# Altium project PATHOS_ControllerBoardExp.PrjPCB (part 1 of 2)
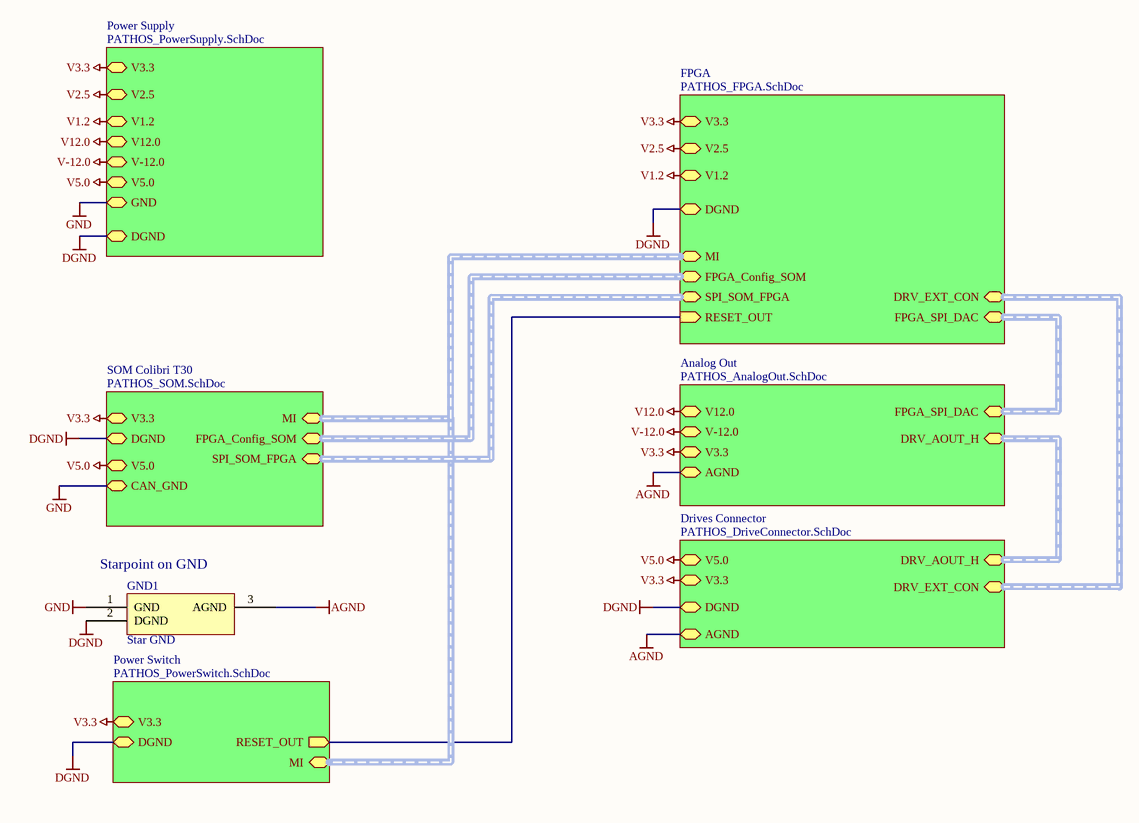
[diagram p0: PATHOS_ControllerBoardExp.SchDoc]
15 sheets, 171 parts. Net scope: strictly hierarchical (ports join the sheet entries above them; power ports are local).
Board file: PATHOS_ControllerBoardExp.PcbDoc
Sheets:
  PATHOS_ControllerBoardExp.SchDoc
    FPGA = PATHOS_FPGA.SchDoc
      Power Supply FPGA = PATHOS_FPGA_Power.SchDoc
      FPGA Clk = PATHOS_FPGA_Clk.SchDoc
      FPGA_IO = PATHOS_FPGA_IO.SchDoc
        IO External = PATHOS_FPGA_IO_Ext.SchDoc
      FPGA MemoryInterface = PATHOS_FPGA_MemoryInterface.SchDoc
    SOM Colibri T30 = PATHOS_SOM.SchDoc
      Power Supply = PATHOS_SOM_Power.SchDoc
      SOM IOs = PATHOS_SOM_IO.SchDoc
      SOM UART = PATHOS_SOM_UART.SchDoc
      SOM Ethernet = PATHOS_SOM_Ethernet.SchDoc
      SOM CAN = PATHOS_SOM_CAN.SchDoc
    Power Switch = PATHOS_PowerSwitch.SchDoc
    Analog Out = PATHOS_AnalogOut.SchDoc

## Sheet PATHOS_ControllerBoardExp.SchDoc: Main Schematic
size A4; Author: A. Kalberer; CompanyName: NTB; Organization: NTB Interstate University of Applied; Address1: Werdenbergstrasse 4; Address3: 9471 Buchs; Address4: Switzerland; Revision: 0.1; SheetNumber: 1; SheetTotal: 2; Organization1: Sciences of Technology Buchs; Size: A4

### Parts
GND1  Star GND  [NetTieGND]  (net tie, no BOM)

### Sub-sheets
Analog Out = PATHOS_AnalogOut.SchDoc: FPGA_SPI_DAC (harness FPGA_SPI_DAC), V12.0, V-12.0, AGND, V3.3, DRV_AOUT_H (harness DRV_AOUT_H)
Drives Connector = PATHOS_DriveConnector.SchDoc (file not in this document): DRV_EXT_CON (harness DRV_EXT_CON), DRV_AOUT_H (harness DRV_AOUT_H), V5.0, DGND, AGND, V3.3
FPGA = PATHOS_FPGA.SchDoc: V3.3, V2.5, V1.2, DGND (bidir), MI (harness MI), FPGA_Config_SOM (harness FPGA_Config_SOM), RESET_OUT (in), SPI_SOM_FPGA (harness SPI_SOM_FPGA), FPGA_SPI_DAC (harness FPGA_SPI_DAC), DRV_EXT_CON (harness DRV_EXT_CON)
Power Supply = PATHOS_PowerSupply.SchDoc (file not in this document): GND, V1.2, V2.5, V3.3, V5.0, V12.0, V-12.0, DGND
Power Switch = PATHOS_PowerSwitch.SchDoc: V3.3, DGND, MI (harness MI), RESET_OUT (out)
SOM Colibri T30 = PATHOS_SOM.SchDoc: V3.3, DGND (bidir), MI (harness MI), FPGA_Config_SOM (harness FPGA_Config_SOM), SPI_SOM_FPGA (harness SPI_SOM_FPGA), V5.0, CAN_GND

### Nets
AGND: GND1.3(AGND) ; sheet Analog Out/AGND, sheet Drives Connector/AGND
DGND: GND1.2(DGND) ; sheet Power Supply/DGND, sheet FPGA/DGND, sheet SOM Colibri T30/DGND, sheet Power Switch/DGND, sheet Drives Connector/DGND
GND: GND1.1(GND) ; sheet Power Supply/GND, sheet SOM Colibri T30/CAN_GND  [project net CAN_GND]
V1.2: sheet Power Supply/V1.2, sheet FPGA/V1.2
V2.5: sheet Power Supply/V2.5, sheet FPGA/V2.5
V3.3: sheet Power Supply/V3.3, sheet FPGA/V3.3, sheet SOM Colibri T30/V3.3, sheet Power Switch/V3.3, sheet Analog Out/V3.3, sheet Drives Connector/V3.3
V5.0: sheet Power Supply/V5.0, sheet SOM Colibri T30/V5.0, sheet Drives Connector/V5.0
V12.0: sheet Power Supply/V12.0, sheet Analog Out/V12.0
V-12.0: sheet Power Supply/V-12.0, sheet Analog Out/V-12.0
RESET_OUT: sheet FPGA/RESET_OUT, sheet Power Switch/RESET_OUT

### Buses and harness runs
harness sheet Analog Out/DRV_AOUT_H = sheet Drives Connector/DRV_AOUT_H
harness sheet Analog Out/FPGA_SPI_DAC = sheet FPGA/FPGA_SPI_DAC
harness sheet Drives Connector/DRV_EXT_CON = sheet FPGA/DRV_EXT_CON
harness sheet FPGA/FPGA_Config_SOM = sheet SOM Colibri T30/FPGA_Config_SOM
harness sheet FPGA/MI = sheet Power Switch/MI = sheet SOM Colibri T30/MI
harness sheet FPGA/SPI_SOM_FPGA = sheet SOM Colibri T30/SPI_SOM_FPGA

### Notes on the sheet
- (near GND1) Starpoint on GND
- Title:
- Description:
- Size:
- Date:
- Name:
- Number:
- Time:
- Revision:
- Sheet
- Checked:
- of
- File:

### Library data of the parts
GND1 = NetTie

## Sheet PATHOS_FPGA.SchDoc: FPGA Overview
size A4; Author: A. Kalberer; CompanyName: NTB; Organization: NTB Interstate University of Applied; Address1: Werdenbergstrasse 4; Address3: 9471 Buchs; Address4: Switzerland; Revision: 0.1; Organization1: Sciences of Technology Buchs; Size: A4
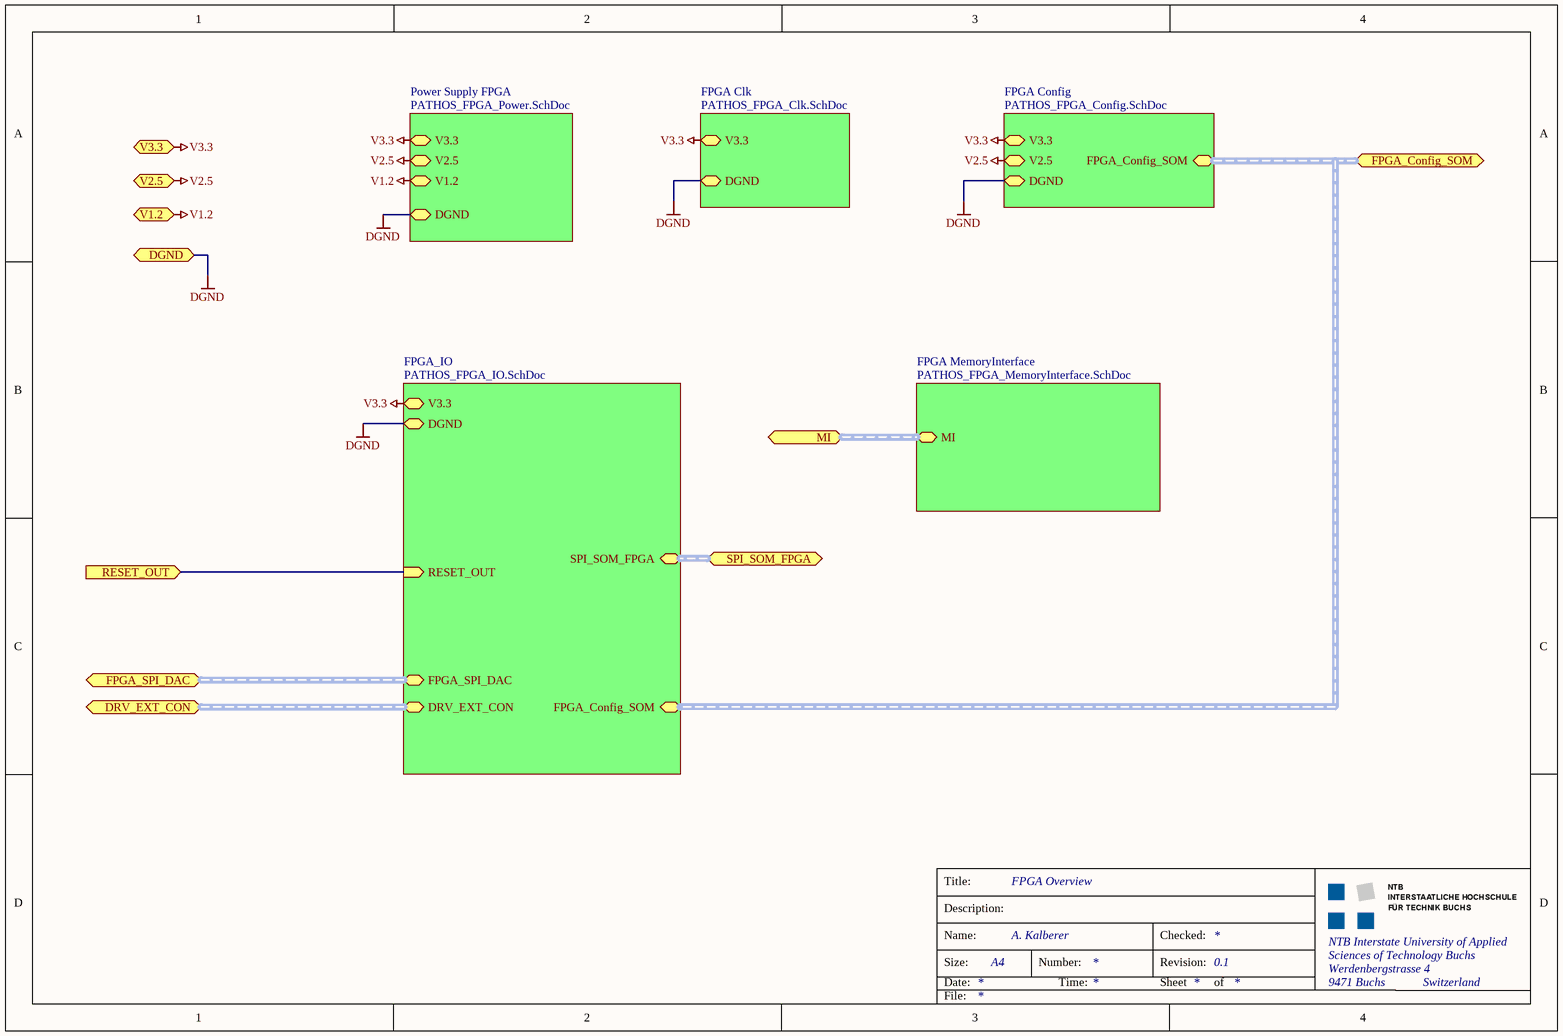
[diagram p1: PATHOS_FPGA.SchDoc]

### Sub-sheets
FPGA Clk = PATHOS_FPGA_Clk.SchDoc: V3.3, DGND
FPGA Config = PATHOS_FPGA_Config.SchDoc (file not in this document): V3.3, DGND, V2.5, FPGA_Config_SOM (harness FPGA_Config_SOM)
FPGA MemoryInterface = PATHOS_FPGA_MemoryInterface.SchDoc: MI (harness MI)
FPGA_IO = PATHOS_FPGA_IO.SchDoc: RESET_OUT (in), SPI_SOM_FPGA (harness SPI_SOM_FPGA), FPGA_Config_SOM (harness FPGA_Config_SOM), FPGA_SPI_DAC (harness FPGA_SPI_DAC), V3.3, DGND, DRV_EXT_CON (harness DRV_EXT_CON)
Power Supply FPGA = PATHOS_FPGA_Power.SchDoc: V3.3, V2.5, V1.2, DGND

### Ports
DGND, DRV_EXT_CON (harness DRV_EXT_CON), FPGA_Config_SOM (harness FPGA_Config_SOM), FPGA_SPI_DAC (harness FPGA_SPI_DAC), MI (harness MI), RESET_OUT (in), SPI_SOM_FPGA (harness SPI_SOM_FPGA), V1.2, V2.5, V3.3

### Nets
DGND: port DGND, sheet Power Supply FPGA/DGND, sheet FPGA Clk/DGND, sheet FPGA_IO/DGND, sheet FPGA Config/DGND
V1.2: port V1.2, sheet Power Supply FPGA/V1.2
V2.5: port V2.5, sheet Power Supply FPGA/V2.5, sheet FPGA Config/V2.5
V3.3: port V3.3, sheet Power Supply FPGA/V3.3, sheet FPGA Clk/V3.3, sheet FPGA_IO/V3.3, sheet FPGA Config/V3.3
RESET_OUT: port RESET_OUT, sheet FPGA_IO/RESET_OUT

### Buses and harness runs
harness port DRV_EXT_CON = sheet FPGA_IO/DRV_EXT_CON
harness port FPGA_Config_SOM = sheet FPGA Config/FPGA_Config_SOM = sheet FPGA_IO/FPGA_Config_SOM
harness port FPGA_SPI_DAC = sheet FPGA_IO/FPGA_SPI_DAC
harness port MI = sheet FPGA MemoryInterface/MI
harness port SPI_SOM_FPGA = sheet FPGA_IO/SPI_SOM_FPGA

### Notes on the sheet
- Title:
- Description:
- Size:
- Date:
- Name:
- Number:
- Time:
- Revision:
- Sheet
- Checked:
- of
- File:

## Sheet PATHOS_FPGA_Power.SchDoc: FPGA Power
size A4; Author: A. Kalberer; CompanyName: NTB; Organization: NTB Interstate University of Applied; Address1: Werdenbergstrasse 4; Address3: 9471 Buchs; Address4: Switzerland; Organization1: Sciences of Technology Buchs; Size: A4
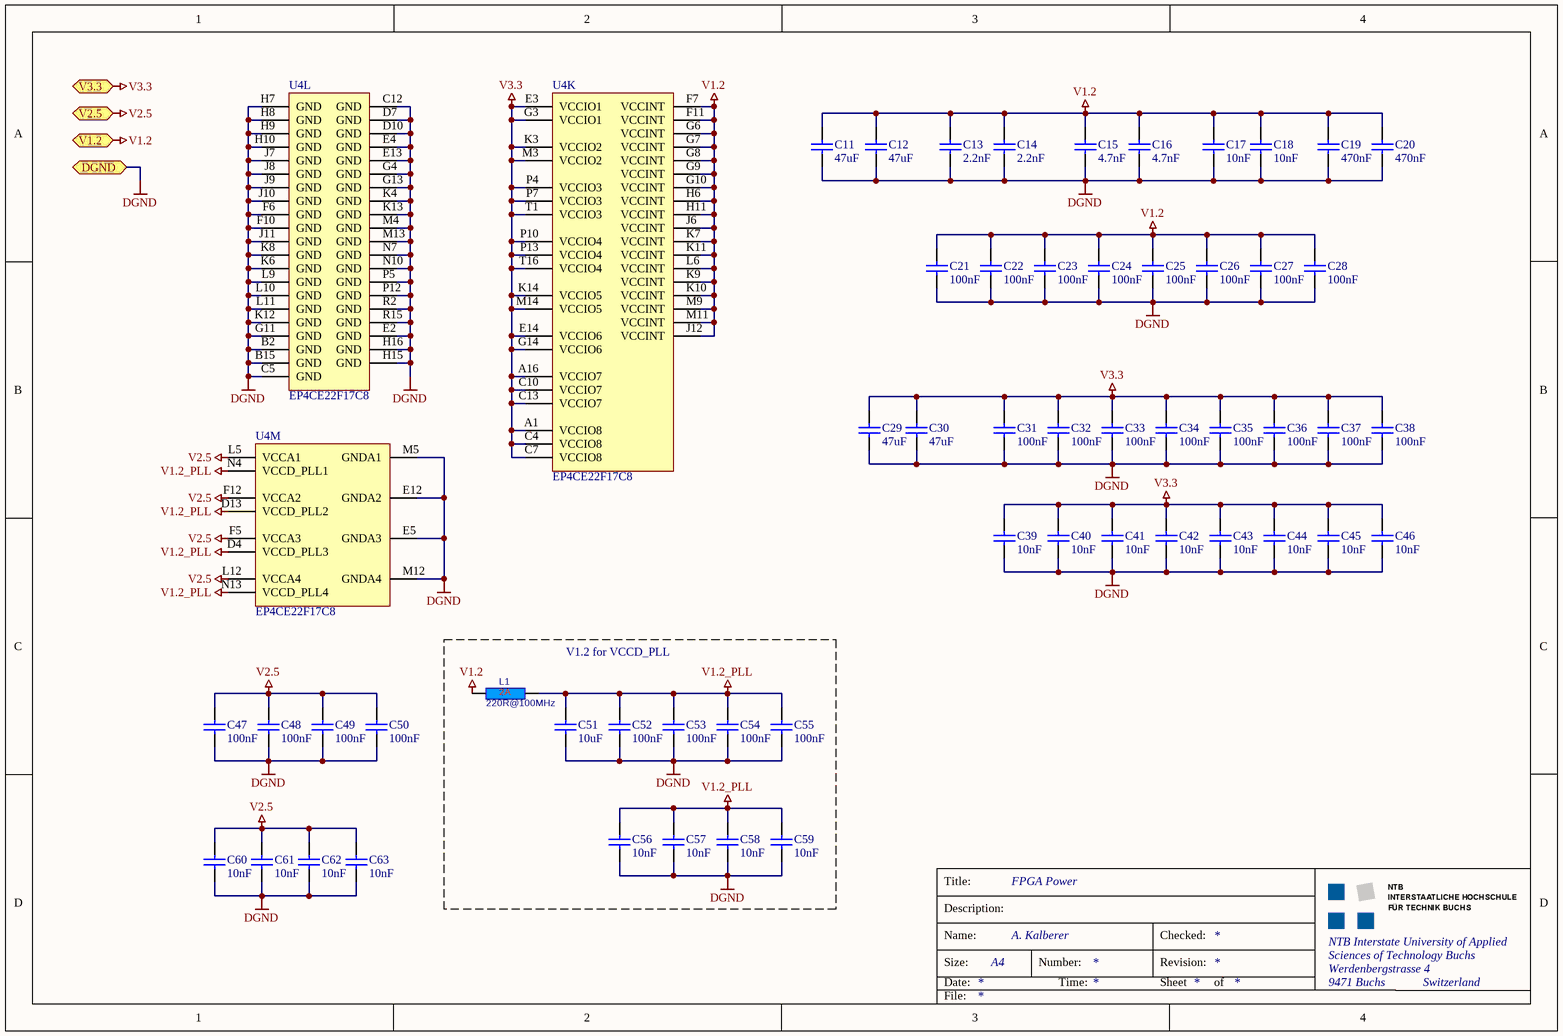
[diagram p2: PATHOS_FPGA_Power.SchDoc]

### Parts
C11  47uF  [0805_3D]
C12  47uF  [0805_3D]
C13  2.2nF  [0402_3D]
C14  2.2nF  [0402_3D]
C15  4.7nF  [0402_3D]
C16  4.7nF  [0402_3D]
C17  10nF  [0402_3D]
C18  10nF  [0402_3D]
C19  470nF  [0603_3D]
C20  470nF  [0603_3D]
C21  100nF  [0402_3D]
C22  100nF  [0402_3D]
C23  100nF  [0402_3D]
C24  100nF  [0402_3D]
C25  100nF  [0402_3D]
C26  100nF  [0402_3D]
C27  100nF  [0402_3D]
C28  100nF  [0402_3D]
C29  47uF  [0805_3D]
C30  47uF  [0805_3D]
C31  100nF  [0402_3D]
C32  100nF  [0402_3D]
C33  100nF  [0402_3D]
C34  100nF  [0402_3D]
C35  100nF  [0402_3D]
C36  100nF  [0402_3D]
C37  100nF  [0402_3D]
C38  100nF  [0402_3D]
C39  10nF  [0402_3D]
C40  10nF  [0402_3D]
C41  10nF  [0402_3D]
C42  10nF  [0402_3D]
C43  10nF  [0402_3D]
C44  10nF  [0402_3D]
C45  10nF  [0402_3D]
C46  10nF  [0402_3D]
C47  100nF  [0402_3D]
C48  100nF  [0402_3D]
C49  100nF  [0402_3D]
C50  100nF  [0402_3D]
C51  10uF  [0603_3D]
C52  100nF  [0402_3D]
C53  100nF  [0402_3D]
C54  100nF  [0402_3D]
C55  100nF  [0402_3D]
C56  10nF  [0402_3D]
C57  10nF  [0402_3D]
C58  10nF  [0402_3D]
C59  10nF  [0402_3D]
C60  10nF  [0402_3D]
C61  10nF  [0402_3D]
C62  10nF  [0402_3D]
C63  10nF  [0402_3D]
L1  220R@100MHz  [0603_3D]
U4  EP4CE22F17C8  [FBGA256]  (parts K,L,M of 13)

### Blocks framed on the sheet
V1.2 for VCCD_PLL: C51-C59 L1

### Ports
DGND, V1.2, V2.5, V3.3

### Nets
DGND: C11.1 C12.1 C13.1 C14.1 C15.1 C16.1 C17.1 C18.1 C19.1 C20.1 C21.1 C22.1 C23.1 C24.1 C25.1 C26.1 C27.1 C28.1 C29.1 C30.1 C31.1 C32.1 C33.1 C34.1 C35.1 C36.1 C37.1 C38.1 C39.1 C40.1 C41.1 C42.1 C43.1 C44.1 C45.1 C46.1 C47.1 C48.1 C49.1 C50.1 C51.1 C52.1 C53.1 C54.1 C55.1 C56.1 C57.1 C58.1 C59.1 C60.1 C61.1 C62.1 C63.1 U4.B2(GND) U4.B15(GND) U4.C5(GND) U4.C12(GND) U4.D7(GND) U4.D10(GND) U4.E2(GND) U4.E4(GND) U4.E5(GNDA3) U4.E12(GNDA2) U4.E13(GND) U4.F6(GND) U4.F10(GND) U4.G4(GND) U4.G11(GND) U4.G13(GND) U4.H7(GND) U4.H8(GND) U4.H9(GND) U4.H10(GND) U4.H15(GND) U4.H16(GND) U4.J7(GND) U4.J8(GND) U4.J9(GND) U4.J10(GND) U4.J11(GND) U4.K4(GND) U4.K6(GND) U4.K8(GND) U4.K12(GND) U4.K13(GND) U4.L9(GND) U4.L10(GND) U4.L11(GND) U4.M4(GND) U4.M5(GNDA1) U4.M12(GNDA4) U4.M13(GND) U4.N7(GND) U4.N10(GND) U4.P5(GND) U4.P12(GND) U4.R2(GND) U4.R15(GND) ; port DGND
V1.2: C11.2 C12.2 C13.2 C14.2 C15.2 C16.2 C17.2 C18.2 C19.2 C20.2 C21.2 C22.2 C23.2 C24.2 C25.2 C26.2 C27.2 C28.2 L1.1 U4.F7(VCCINT) U4.F11(VCCINT) U4.G6(VCCINT) U4.G7(VCCINT) U4.G8(VCCINT) U4.G9(VCCINT) U4.G10(VCCINT) U4.H6(VCCINT) U4.H11(VCCINT) U4.J6(VCCINT) U4.J12(VCCINT) U4.K7(VCCINT) U4.K9(VCCINT) U4.K10(VCCINT) U4.K11(VCCINT) U4.L6(VCCINT) U4.M9(VCCINT) U4.M11(VCCINT) ; port V1.2
V1.2_PLL: C51.2 C52.2 C53.2 C54.2 C55.2 C56.2 C57.2 C58.2 C59.2 L1.2 U4.D4(VCCD_PLL3) U4.D13(VCCD_PLL2) U4.N4(VCCD_PLL1) U4.N13(VCCD_PLL4)
V2.5: C47.2 C48.2 C49.2 C50.2 C60.2 C61.2 C62.2 C63.2 U4.F5(VCCA3) U4.F12(VCCA2) U4.L5(VCCA1) U4.L12(VCCA4) ; port V2.5
V3.3: C29.2 C30.2 C31.2 C32.2 C33.2 C34.2 C35.2 C36.2 C37.2 C38.2 C39.2 C40.2 C41.2 C42.2 C43.2 C44.2 C45.2 C46.2 U4.A1(VCCIO8) U4.A16(VCCIO7) U4.C4(VCCIO8) U4.C7(VCCIO8) U4.C10(VCCIO7) U4.C13(VCCIO7) U4.E3(VCCIO1) U4.E14(VCCIO6) U4.G3(VCCIO1) U4.G14(VCCIO6) U4.K3(VCCIO2) U4.K14(VCCIO5) U4.M3(VCCIO2) U4.M14(VCCIO5) U4.P4(VCCIO3) U4.P7(VCCIO3) U4.P10(VCCIO4) U4.P13(VCCIO4) U4.T1(VCCIO3) U4.T16(VCCIO4) ; port V3.3

### Notes on the sheet
- Title:
- Description:
- Size:
- Date:
- Name:
- Number:
- Time:
- Revision:
- Sheet
- Checked:
- of
- File:

### Library data of the parts
C11 C12 C29 C30 = C: Capacitor; #Manufacturer: Generic Components; #Publisher: Dr. A. Heinzelmann; #Class: Passive; Initial Voltage: 0V; Type: Ceramic; #Published: 2006-10-07; #ClassSub: Capacitor; Voltage Maximum: *; Value: 47uF
C13-C28 C31-C63 = C: Capacitor; #Manufacturer: Generic Components; #Publisher: Dr. A. Heinzelmann; #Class: Passive; Initial Voltage: 0V; #Published: 2006-10-07; #ClassSub: Capacitor; Type: *; Voltage Maximum: *
  C13 C14: Value: 2.2nF
  C15 C16: Value: 4.7nF
  C17 C18 C39-C46 C56-C63: Value: 10nF
  C19 C20: Value: 470nF
  C21-C28 C31-C38 C47-C50 C52-C55: Value: 100nF
  C51: Value: 10uF
L1 = L-220R@100MHz-2A-25%-0603: 220R@100MHz 2A EMI FILTER; Tolerance: 25%; Rating: 2A; Value: 220R@100MHz
U4 = EP4CE22F17C8: Cyclone IV Family FPGA, 2V Core, 153 I/O Pins, 4 PLLs, 256-Pin FBGA, Speed Grade 8, Commercial Grade; Published: 3-May-2010; DatasheetVersion: ver1.2, Mar-2010; PackageVersion: ver16.0, Dec-2009; PackageReference: FBGA256; Publisher: Altium Limited; PackageDescription: 256-Ball FineLine Ball Grid Array (FBGA256) - Option 1 - Wire Bond; Supplier 1: Digi-Key; Supplier Part Number 1: EP4CE22F17C8-ND; Code_JEDEC: MS-034-AAF-1; Code_IPC: BGA100P16X16-256; ComponentLink1Description: Manufacturer Link; ComponentLink1URL: http://www.altera.com/; ComponentLink2Description: Handbook; ComponentLink2URL: http://www.altera.com/literature/hb/cyclone-iv/cyclone4-handbook.pdf; ComponentLink3Description: Pinout Specification; ComponentLink3URL: http://www.altera.com/literature/lit-dp.jsp?category=cyc%204&showspreadsheet=y; ComponentLink4Description: Packaging Specification; ComponentLink4URL: http://www.altera.com/literature/ds/dspkg.pdf

## Sheet PATHOS_FPGA_Clk.SchDoc: FPGA Clock
size A4; Author: A. Kalberer; CompanyName: NTB; Organization: NTB Interstate University of Applied; Address1: Werdenbergstrasse 4; Address3: 9471 Buchs; Address4: Switzerland; Organization1: Sciences of Technology Buchs; Size: A4
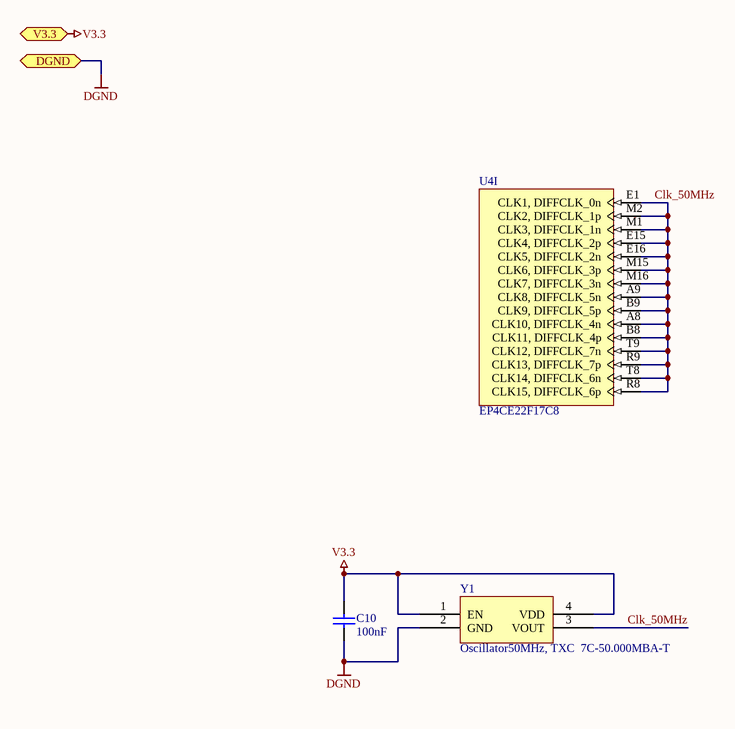
[diagram p3: PATHOS_FPGA_Clk.SchDoc]

### Parts
C10  100nF  [0603_3D]
U4  EP4CE22F17C8  [FBGA256]  (part I of 13)
Y1  Oscillator50MHz, TXC  7C-50.000MBA-T  [OSC_50MHz_TXC]

### Ports
DGND (bidir), V3.3 (in)

### Nets
DGND: C10.1 Y1.2(GND) ; port DGND
V3.3: C10.2 Y1.1(EN) Y1.4(VDD) ; port V3.3
Clk_50MHz: U4.A8(CLK10,_DIFFCLK_4n) U4.A9(CLK8,_DIFFCLK_5n) U4.B8(CLK11,_DIFFCLK_4p) U4.B9(CLK9,_DIFFCLK_5p) U4.E1(CLK1,_DIFFCLK_0n) U4.E15(CLK4,_DIFFCLK_2p) U4.E16(CLK5,_DIFFCLK_2n) U4.M1(CLK3,_DIFFCLK_1n) U4.M2(CLK2,_DIFFCLK_1p) U4.M15(CLK6,_DIFFCLK_3p) U4.M16(CLK7,_DIFFCLK_3n) U4.R8(CLK15,_DIFFCLK_6p) U4.R9(CLK13,_DIFFCLK_7p) U4.T8(CLK14,_DIFFCLK_6n) U4.T9(CLK12,_DIFFCLK_7n) Y1.3(VOUT)

### Notes on the sheet
- Title:
- Description:
- Size:
- Date:
- Name:
- Number:
- Time:
- Revision:
- Sheet
- Checked:
- of
- File:

### Library data of the parts
C10 = C: as C13 on sheet PATHOS_FPGA_Power; #Published: 2006-10-07; #ClassSub: Capacitor; Type: *; Voltage Maximum: *; Value: 100nF
U4 = EP4CE22F17C8: as U4 on sheet PATHOS_FPGA_Power; Published: 3-May-2010; DatasheetVersion: ver1.2, Mar-2010; PackageVersion: ver16.0, Dec-2009; PackageReference: FBGA256; Publisher: Altium Limited; PackageDescription: 256-Ball FineLine Ball Grid Array (FBGA256) - Option 1 - Wire Bond; Supplier 1: Digi-Key; Supplier Part Number 1: EP4CE22F17C8-ND; Code_JEDEC: MS-034-AAF-1; Code_IPC: BGA100P16X16-256; ComponentLink1Description: Manufacturer Link; ComponentLink1URL: http://www.altera.com/; ComponentLink2Description: Handbook; ComponentLink2URL: http://www.altera.com/literature/hb/cyclone-iv/cyclone4-handbook.pdf; ComponentLink3Description: Pinout Specification; ComponentLink3URL: http://www.altera.com/literature/lit-dp.jsp?category=cyc%204&showspreadsheet=y; ComponentLink4Description: Packaging Specification; ComponentLink4URL: http://www.altera.com/literature/ds/dspkg.pdf
Y1 = Oscillator50MHz

## Sheet PATHOS_FPGA_IO.SchDoc: FPGA IO
size A3; Author: A. Kalberer; CompanyName: NTB; Organization: NTB Interstate University of Applied; Address1: Werdenbergstrasse 4; Address3: 9471 Buchs; Address4: Switzerland; Organization1: Sciences of Technology Buchs; Size: A3
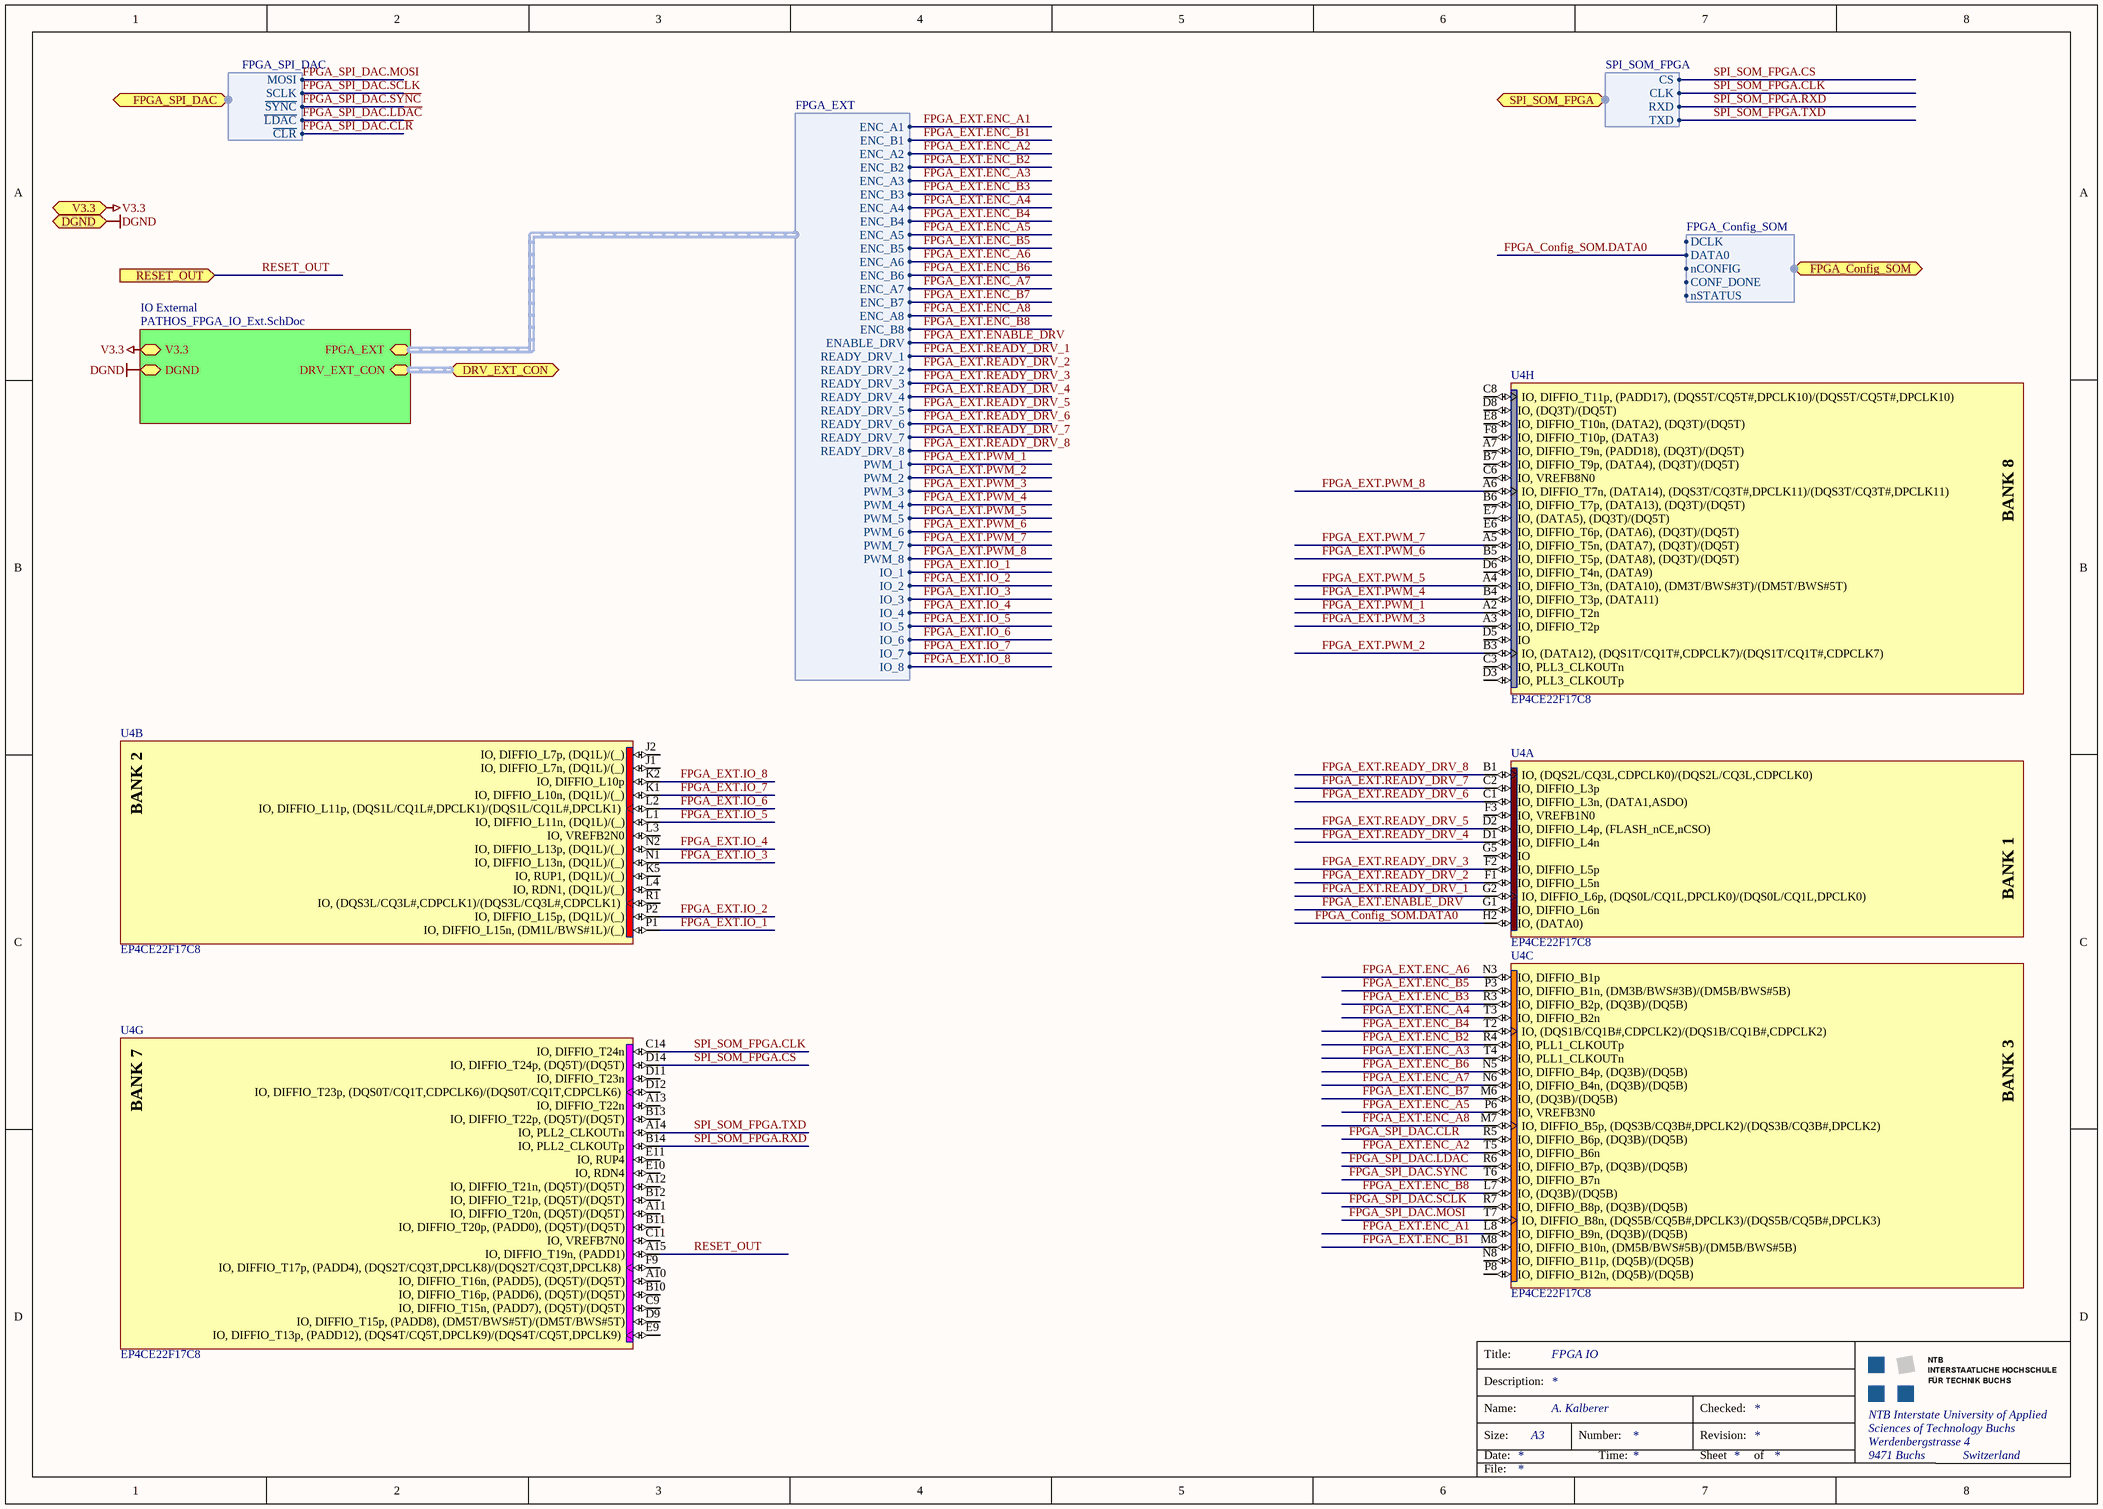
[diagram p4: PATHOS_FPGA_IO.SchDoc]

### Parts
U4  EP4CE22F17C8  [FBGA256]  (parts A,B,C,G,H of 13)

### Sub-sheets
IO External = PATHOS_FPGA_IO_Ext.SchDoc: V3.3, DGND, FPGA_EXT (harness FPGA_EXT), DRV_EXT_CON (harness DRV_EXT_CON)

### Ports
DGND, DRV_EXT_CON (harness DRV_EXT_CON), FPGA_Config_SOM (harness FPGA_Config_SOM), FPGA_SPI_DAC (harness FPGA_SPI_DAC), RESET_OUT (in), SPI_SOM_FPGA (harness SPI_SOM_FPGA), V3.3

### Harnesses
SPI_SOM_FPGA: CS, CLK, RXD, TXD
FPGA_Config_SOM: DCLK, DATA0, nCONFIG, CONF_DONE, nSTATUS
FPGA_SPI_DAC: MOSI, SCLK, ~{SYNC}, ~{LDAC}, ~{CLR}
FPGA_EXT: ENC_A1, ENC_B1, ENC_A2, ENC_B2, ENC_A3, ENC_B3, ENC_A4, ENC_B4, PWM_1, ENABLE_DRV, READY_DRV_4, READY_DRV_3, READY_DRV_2, READY_DRV_1, IO_1, IO_2, ENC_A5, ENC_B5, ENC_A6, ENC_B6, ENC_A7, ENC_B7, ENC_A8, ENC_B8, READY_DRV_5, READY_DRV_6, READY_DRV_7, READY_DRV_8, PWM_2, PWM_3, PWM_4, PWM_5, PWM_6, PWM_7, PWM_8, IO_3, IO_4, IO_5, IO_6, IO_7, IO_8

### Nets
DGND: port DGND, sheet IO External/DGND
V3.3: port V3.3, sheet IO External/V3.3
FPGA_Config_SOM.DATA0: U4.H2(IO,_(DATA0)) ; port FPGA_Config_SOM.DATA0
FPGA_EXT.ENABLE_DRV: U4.G1(IO,_DIFFIO_L6n) ; sheet IO External/FPGA_EXT.ENABLE_DRV
FPGA_EXT.ENC_A1: U4.L8(IO,_DIFFIO_B9n,_(DQ3B)/(DQ5B)) ; sheet IO External/FPGA_EXT.ENC_A1
FPGA_EXT.ENC_A2: U4.T5(IO,_DIFFIO_B6n) ; sheet IO External/FPGA_EXT.ENC_A2
FPGA_EXT.ENC_A3: U4.T4(IO,_PLL1_CLKOUTn) ; sheet IO External/FPGA_EXT.ENC_A3
FPGA_EXT.ENC_A4: U4.T3(IO,_DIFFIO_B2n) ; sheet IO External/FPGA_EXT.ENC_A4
FPGA_EXT.ENC_A5: U4.P6(IO,_VREFB3N0) ; sheet IO External/FPGA_EXT.ENC_A5
FPGA_EXT.ENC_A6: U4.N3(IO,_DIFFIO_B1p) ; sheet IO External/FPGA_EXT.ENC_A6
FPGA_EXT.ENC_A7: U4.N6(IO,_DIFFIO_B4n,_(DQ3B)/(DQ5B)) ; sheet IO External/FPGA_EXT.ENC_A7
FPGA_EXT.ENC_A8: U4.M7(IO,_DIFFIO_B5p,_(DQS3B/CQ3B#,DPCLK2)/(DQS3B/CQ3B#,DPCLK2)) ; sheet IO External/FPGA_EXT.ENC_A8
FPGA_EXT.ENC_B1: U4.M8(IO,_DIFFIO_B10n,_(DM5B/BWS#5B)/(DM5B/BWS#5B)) ; sheet IO External/FPGA_EXT.ENC_B1
FPGA_EXT.ENC_B2: U4.R4(IO,_PLL1_CLKOUTp) ; sheet IO External/FPGA_EXT.ENC_B2
FPGA_EXT.ENC_B3: U4.R3(IO,_DIFFIO_B2p,_(DQ3B)/(DQ5B)) ; sheet IO External/FPGA_EXT.ENC_B3
FPGA_EXT.ENC_B4: U4.T2(IO,_(DQS1B/CQ1B#,CDPCLK2)/(DQS1B/CQ1B#,CDPCLK2)) ; sheet IO External/FPGA_EXT.ENC_B4
FPGA_EXT.ENC_B5: U4.P3(IO,_DIFFIO_B1n,_(DM3B/BWS#3B)/(DM5B/BWS#5B)) ; sheet IO External/FPGA_EXT.ENC_B5
FPGA_EXT.ENC_B6: U4.N5(IO,_DIFFIO_B4p,_(DQ3B)/(DQ5B)) ; sheet IO External/FPGA_EXT.ENC_B6
FPGA_EXT.ENC_B7: U4.M6(IO,_(DQ3B)/(DQ5B)) ; sheet IO External/FPGA_EXT.ENC_B7
FPGA_EXT.ENC_B8: U4.L7(IO,_(DQ3B)/(DQ5B)) ; sheet IO External/FPGA_EXT.ENC_B8
FPGA_EXT.IO_1: U4.P1(IO,_DIFFIO_L15n,_(DM1L/BWS#1L)/(_)) ; sheet IO External/FPGA_EXT.IO_1
FPGA_EXT.IO_2: U4.P2(IO,_DIFFIO_L15p,_(DQ1L)/(_)) ; sheet IO External/FPGA_EXT.IO_2
FPGA_EXT.IO_3: U4.N1(IO,_DIFFIO_L13n,_(DQ1L)/(_)) ; sheet IO External/FPGA_EXT.IO_3
FPGA_EXT.IO_4: U4.N2(IO,_DIFFIO_L13p,_(DQ1L)/(_)) ; sheet IO External/FPGA_EXT.IO_4
FPGA_EXT.IO_5: U4.L1(IO,_DIFFIO_L11n,_(DQ1L)/(_)) ; sheet IO External/FPGA_EXT.IO_5
FPGA_EXT.IO_6: U4.L2(IO,_DIFFIO_L11p,_(DQS1L/CQ1L#,DPCLK1)/(DQS1L/CQ1L#,DPCLK1)) ; sheet IO External/FPGA_EXT.IO_6
FPGA_EXT.IO_7: U4.K1(IO,_DIFFIO_L10n,_(DQ1L)/(_)) ; sheet IO External/FPGA_EXT.IO_7
FPGA_EXT.IO_8: U4.K2(IO,_DIFFIO_L10p) ; sheet IO External/FPGA_EXT.IO_8
FPGA_EXT.PWM_1: U4.A2(IO,_DIFFIO_T2n) ; sheet IO External/FPGA_EXT.PWM_1
FPGA_EXT.PWM_2: U4.B3(IO,_(DATA12),_(DQS1T/CQ1T#,CDPCLK7)/(DQS1T/CQ1T#,CDPCLK7)) ; sheet IO External/FPGA_EXT.PWM_2
FPGA_EXT.PWM_3: U4.A3(IO,_DIFFIO_T2p) ; sheet IO External/FPGA_EXT.PWM_3
FPGA_EXT.PWM_4: U4.B4(IO,_DIFFIO_T3p,_(DATA11)) ; sheet IO External/FPGA_EXT.PWM_4
FPGA_EXT.PWM_5: U4.A4(IO,_DIFFIO_T3n,_(DATA10),_(DM3T/BWS#3T)/(DM5T/BWS#5T)) ; sheet IO External/FPGA_EXT.PWM_5
FPGA_EXT.PWM_6: U4.B5(IO,_DIFFIO_T5p,_(DATA8),_(DQ3T)/(DQ5T)) ; sheet IO External/FPGA_EXT.PWM_6
FPGA_EXT.PWM_7: U4.A5(IO,_DIFFIO_T5n,_(DATA7),_(DQ3T)/(DQ5T)) ; sheet IO External/FPGA_EXT.PWM_7
FPGA_EXT.PWM_8: U4.A6(IO,_DIFFIO_T7n,_(DATA14),_(DQS3T/CQ3T#,DPCLK11)/(DQS3T/CQ3T#,DPCLK11)) ; sheet IO External/FPGA_EXT.PWM_8
FPGA_EXT.READY_DRV_1: U4.G2(IO,_DIFFIO_L6p,_(DQS0L/CQ1L,DPCLK0)/(DQS0L/CQ1L,DPCLK0)) ; sheet IO External/FPGA_EXT.READY_DRV_1
FPGA_EXT.READY_DRV_2: U4.F1(IO,_DIFFIO_L5n) ; sheet IO External/FPGA_EXT.READY_DRV_2
FPGA_EXT.READY_DRV_3: U4.F2(IO,_DIFFIO_L5p) ; sheet IO External/FPGA_EXT.READY_DRV_3
FPGA_EXT.READY_DRV_4: U4.D1(IO,_DIFFIO_L4n) ; sheet IO External/FPGA_EXT.READY_DRV_4
FPGA_EXT.READY_DRV_5: U4.D2(IO,_DIFFIO_L4p,_(FLASH_nCE,nCSO)) ; sheet IO External/FPGA_EXT.READY_DRV_5
FPGA_EXT.READY_DRV_6: U4.C1(IO,_DIFFIO_L3n,_(DATA1,ASDO)) ; sheet IO External/FPGA_EXT.READY_DRV_6
FPGA_EXT.READY_DRV_7: U4.C2(IO,_DIFFIO_L3p) ; sheet IO External/FPGA_EXT.READY_DRV_7
FPGA_EXT.READY_DRV_8: U4.B1(IO,_(DQS2L/CQ3L,CDPCLK0)/(DQS2L/CQ3L,CDPCLK0)) ; sheet IO External/FPGA_EXT.READY_DRV_8
FPGA_SPI_DAC.~{CLR}: U4.R5(IO,_DIFFIO_B6p,_(DQ3B)/(DQ5B)) ; port FPGA_SPI_DAC.~{CLR}
FPGA_SPI_DAC.~{LDAC}: U4.R6(IO,_DIFFIO_B7p,_(DQ3B)/(DQ5B)) ; port FPGA_SPI_DAC.~{LDAC}
FPGA_SPI_DAC.MOSI: U4.T7(IO,_DIFFIO_B8n,_(DQS5B/CQ5B#,DPCLK3)/(DQS5B/CQ5B#,DPCLK3)) ; port FPGA_SPI_DAC.MOSI
FPGA_SPI_DAC.~{SYNC}: U4.T6(IO,_DIFFIO_B7n) ; port FPGA_SPI_DAC.~{SYNC}
FPGA_SPI_DAC.SCLK: U4.R7(IO,_DIFFIO_B8p,_(DQ3B)/(DQ5B)) ; port FPGA_SPI_DAC.SCLK
RESET_OUT: U4.A15(IO,_DIFFIO_T19n,_(PADD1)) ; port RESET_OUT
SPI_SOM_FPGA.CLK: U4.C14(IO,_DIFFIO_T24n) ; port SPI_SOM_FPGA.CLK
SPI_SOM_FPGA.CS: U4.D14(IO,_DIFFIO_T24p,_(DQ5T)/(DQ5T)) ; port SPI_SOM_FPGA.CS
SPI_SOM_FPGA.RXD: U4.B14(IO,_PLL2_CLKOUTp) ; port SPI_SOM_FPGA.RXD
SPI_SOM_FPGA.TXD: U4.A14(IO,_PLL2_CLKOUTn) ; port SPI_SOM_FPGA.TXD

Not connected (* = marked no-connect by the designer): U4 A7(IO,_DIFFIO_T9n,_(PADD18),_(DQ3T)/(DQ5T)) A10(IO,_DIFFIO_T16n,_(PADD5),_(DQ5T)/(DQ5T)) A11(IO,_DIFFIO_T20n,_(DQ5T)/(DQ5T)) A12(IO,_DIFFIO_T21n,_(DQ5T)/(DQ5T)) A13(IO,_DIFFIO_T22n) B6(IO,_DIFFIO_T7p,_(DATA13),_(DQ3T)/(DQ5T)) B7(IO,_DIFFIO_T9p,_(DATA4),_(DQ3T)/(DQ5T)) B10(IO,_DIFFIO_T16p,_(PADD6),_(DQ5T)/(DQ5T)) B11(IO,_DIFFIO_T20p,_(PADD0),_(DQ5T)/(DQ5T)) B12(IO,_DIFFIO_T21p,_(DQ5T)/(DQ5T)) B13(IO,_DIFFIO_T22p,_(DQ5T)/(DQ5T)) C3(IO,_PLL3_CLKOUTn) C6(IO,_VREFB8N0) C8(IO,_DIFFIO_T11p,_(PADD17),_(DQS5T/CQ5T#,DPCLK10)/(DQS5T/CQ5T#,DPCLK10)) C9(IO,_DIFFIO_T15n,_(PADD7),_(DQ5T)/(DQ5T)) C11(IO,_VREFB7N0) D3(IO,_PLL3_CLKOUTp) D5(IO) D6(IO,_DIFFIO_T4n,_(DATA9)) D8(IO,_(DQ3T)/(DQ5T)) D9(IO,_DIFFIO_T15p,_(PADD8),_(DM5T/BWS#5T)/(DM5T/BWS#5T)) D11(IO,_DIFFIO_T23n) D12(IO,_DIFFIO_T23p,_(DQS0T/CQ1T,CDPCLK6)/(DQS0T/CQ1T,CDPCLK6)) E6(IO,_DIFFIO_T6p,_(DATA6),_(DQ3T)/(DQ5T)) E7(IO,_(DATA5),_(DQ3T)/(DQ5T)) E8(IO,_DIFFIO_T10n,_(DATA2),_(DQ3T)/(DQ5T)) E9(IO,_DIFFIO_T13p,_(PADD12),_(DQS4T/CQ5T,DPCLK9)/(DQS4T/CQ5T,DPCLK9)) E10(IO,_RDN4) E11(IO,_RUP4) F3(IO,_VREFB1N0) F8(IO,_DIFFIO_T10p,_(DATA3)) F9(IO,_DIFFIO_T17p,_(PADD4),_(DQS2T/CQ3T,DPCLK8)/(DQS2T/CQ3T,DPCLK8)) G5(IO) J1(IO,_DIFFIO_L7n,_(DQ1L)/(_)) J2(IO,_DIFFIO_L7p,_(DQ1L)/(_)) K5(IO,_RUP1,_(DQ1L)/(_)) L3(IO,_VREFB2N0) L4(IO,_RDN1,_(DQ1L)/(_)) N8(IO,_DIFFIO_B11p,_(DQ5B)/(DQ5B)) P8(IO,_DIFFIO_B12n,_(DQ5B)/(DQ5B)) R1(IO,_(DQS3L/CQ3L#,CDPCLK1)/(DQS3L/CQ3L#,CDPCLK1))

### Buses and harness runs
harness port DRV_EXT_CON = sheet IO External/DRV_EXT_CON

### Notes on the sheet
- Title:
- Description:
- Size:
- Date:
- Name:
- Number:
- Time:
- Revision:
- Sheet
- Checked:
- of
- File:
- (in symbol EP4CE22F17C8, part A) BANK 1
- (in symbol EP4CE22F17C8, part B) BANK 2
- (in symbol EP4CE22F17C8, part C) BANK 3
- (in symbol EP4CE22F17C8, part G) BANK 7
- (in symbol EP4CE22F17C8, part H) BANK 8

### Library data of the parts
U4 = EP4CE22F17C8: as U4 on sheet PATHOS_FPGA_Power; Published: 3-May-2010; DatasheetVersion: ver1.2, Mar-2010; PackageVersion: ver16.0, Dec-2009; PackageReference: FBGA256; Publisher: Altium Limited; PackageDescription: 256-Ball FineLine Ball Grid Array (FBGA256) - Option 1 - Wire Bond; Supplier 1: Digi-Key; Supplier Part Number 1: EP4CE22F17C8-ND; Code_JEDEC: MS-034-AAF-1; Code_IPC: BGA100P16X16-256; ComponentLink1Description: Manufacturer Link; ComponentLink1URL: http://www.altera.com/; ComponentLink2Description: Handbook; ComponentLink2URL: http://www.altera.com/literature/hb/cyclone-iv/cyclone4-handbook.pdf; ComponentLink3Description: Pinout Specification; ComponentLink3URL: http://www.altera.com/literature/lit-dp.jsp?category=cyc%204&showspreadsheet=y; ComponentLink4Description: Packaging Specification; ComponentLink4URL: http://www.altera.com/literature/ds/dspkg.pdf

## Sheet PATHOS_FPGA_IO_Ext.SchDoc
size A3; CompanyName: NTB; Organization: NTB Interstate University of Applied; Address1: Werdenbergstrasse 4; Address3: 9471 Buchs; Address4: Switzerland; Organization1: Sciences of Technology Buchs; Size: A3
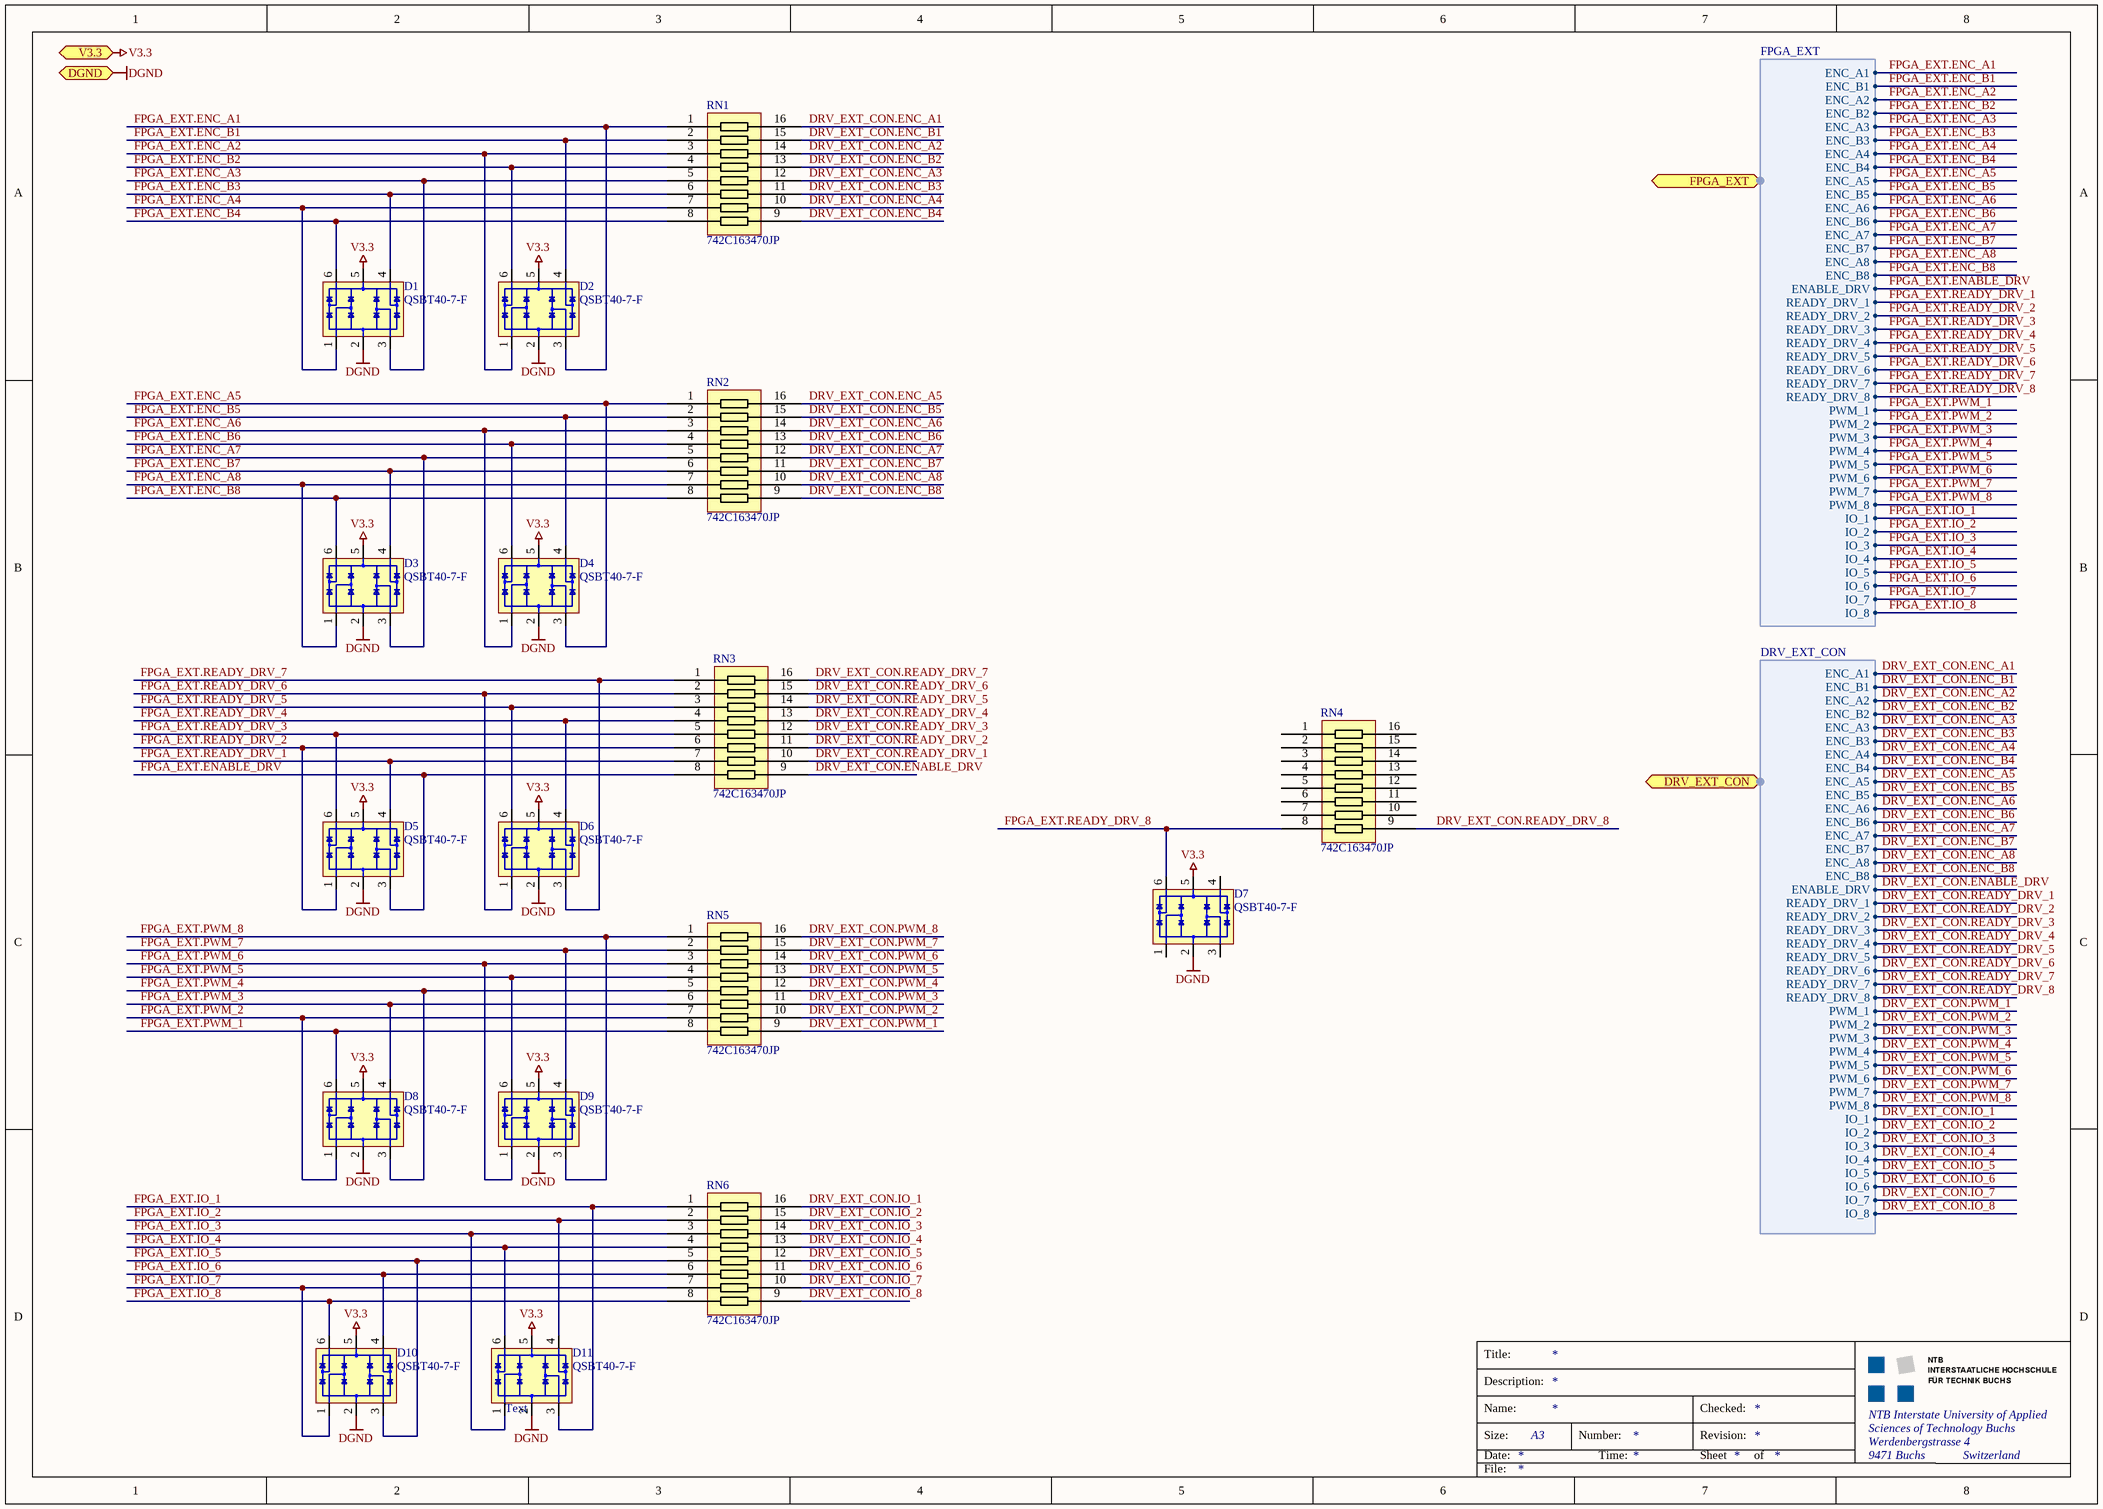
[diagram p5: PATHOS_FPGA_IO_Ext.SchDoc]

### Parts
D1  QSBT40-7-F  [SOT363]
D2  QSBT40-7-F  [SOT363]
D3  QSBT40-7-F  [SOT363]
D4  QSBT40-7-F  [SOT363]
D5  QSBT40-7-F  [SOT363]
D6  QSBT40-7-F  [SOT363]
D7  QSBT40-7-F  [SOT363]
D8  QSBT40-7-F  [SOT363]
D9  QSBT40-7-F  [SOT363]
D10  QSBT40-7-F  [SOT363]
D11  QSBT40-7-F  [SOT363]
RN1  742C163470JP  [742C163470JP]
RN2  742C163470JP  [742C163470JP]
RN3  742C163470JP  [742C163470JP]
RN4  742C163470JP  [742C163470JP]
RN5  742C163470JP  [742C163470JP]
RN6  742C163470JP  [742C163470JP]

### Ports
DGND, DRV_EXT_CON (harness DRV_EXT_CON), FPGA_EXT (harness FPGA_EXT), V3.3

### Harnesses
DRV_EXT_CON: ENC_A1, ENC_B1, ENC_A2, ENC_B2, ENC_A3, ENC_B3, ENC_A4, ENC_B4, ENC_A5, ENC_B5, ENC_A6, ENC_B6, ENC_A7, ENC_B7, ENC_A8, ENC_B8, PWM_1, ENABLE_DRV, READY_DRV_4, READY_DRV_3, READY_DRV_2, READY_DRV_1, IO_1, IO_2, READY_DRV_5, READY_DRV_6, READY_DRV_7, READY_DRV_8, PWM_2, PWM_3, PWM_4, PWM_5, PWM_6, PWM_7, PWM_8, IO_3, IO_4, IO_5, IO_6, IO_7, IO_8
FPGA_EXT: ENC_A1, ENC_B1, ENC_A2, ENC_B2, ENC_A3, ENC_B3, ENC_A4, ENC_B4, PWM_1, ENABLE_DRV, READY_DRV_4, READY_DRV_3, READY_DRV_2, READY_DRV_1, IO_1, IO_2, ENC_A5, ENC_B5, ENC_A6, ENC_B6, ENC_A7, ENC_B7, ENC_A8, ENC_B8, READY_DRV_5, READY_DRV_6, READY_DRV_7, READY_DRV_8, PWM_2, PWM_3, PWM_4, PWM_5, PWM_6, PWM_7, PWM_8, IO_3, IO_4, IO_5, IO_6, IO_7, IO_8

### Nets
DGND: D1.2 D2.2 D3.2 D4.2 D5.2 D6.2 D7.2 D8.2 D9.2 D10.2 D11.2 ; port DGND
V3.3: D1.5 D2.5 D3.5 D4.5 D5.5 D6.5 D7.5 D8.5 D9.5 D10.5 D11.5 ; port V3.3
DRV_EXT_CON.ENABLE_DRV: RN3.9 ; port DRV_EXT_CON.ENABLE_DRV
DRV_EXT_CON.ENC_A1: RN1.16 ; port DRV_EXT_CON.ENC_A1
DRV_EXT_CON.ENC_A2: RN1.14 ; port DRV_EXT_CON.ENC_A2
DRV_EXT_CON.ENC_A3: RN1.12 ; port DRV_EXT_CON.ENC_A3
DRV_EXT_CON.ENC_A4: RN1.10 ; port DRV_EXT_CON.ENC_A4
DRV_EXT_CON.ENC_A5: RN2.16 ; port DRV_EXT_CON.ENC_A5
DRV_EXT_CON.ENC_A6: RN2.14 ; port DRV_EXT_CON.ENC_A6
DRV_EXT_CON.ENC_A7: RN2.12 ; port DRV_EXT_CON.ENC_A7
DRV_EXT_CON.ENC_A8: RN2.10 ; port DRV_EXT_CON.ENC_A8
DRV_EXT_CON.ENC_B1: RN1.15 ; port DRV_EXT_CON.ENC_B1
DRV_EXT_CON.ENC_B2: RN1.13 ; port DRV_EXT_CON.ENC_B2
DRV_EXT_CON.ENC_B3: RN1.11 ; port DRV_EXT_CON.ENC_B3
DRV_EXT_CON.ENC_B4: RN1.9 ; port DRV_EXT_CON.ENC_B4
DRV_EXT_CON.ENC_B5: RN2.15 ; port DRV_EXT_CON.ENC_B5
DRV_EXT_CON.ENC_B6: RN2.13 ; port DRV_EXT_CON.ENC_B6
DRV_EXT_CON.ENC_B7: RN2.11 ; port DRV_EXT_CON.ENC_B7
DRV_EXT_CON.ENC_B8: RN2.9 ; port DRV_EXT_CON.ENC_B8
DRV_EXT_CON.IO_1: RN6.16 ; port DRV_EXT_CON.IO_1
DRV_EXT_CON.IO_2: RN6.15 ; port DRV_EXT_CON.IO_2
DRV_EXT_CON.IO_3: RN6.14 ; port DRV_EXT_CON.IO_3
DRV_EXT_CON.IO_4: RN6.13 ; port DRV_EXT_CON.IO_4
DRV_EXT_CON.IO_5: RN6.12 ; port DRV_EXT_CON.IO_5
DRV_EXT_CON.IO_6: RN6.11 ; port DRV_EXT_CON.IO_6
DRV_EXT_CON.IO_7: RN6.10 ; port DRV_EXT_CON.IO_7
DRV_EXT_CON.IO_8: RN6.9 ; port DRV_EXT_CON.IO_8
DRV_EXT_CON.PWM_1: RN5.9 ; port DRV_EXT_CON.PWM_1
DRV_EXT_CON.PWM_2: RN5.10 ; port DRV_EXT_CON.PWM_2
DRV_EXT_CON.PWM_3: RN5.11 ; port DRV_EXT_CON.PWM_3
DRV_EXT_CON.PWM_4: RN5.12 ; port DRV_EXT_CON.PWM_4
DRV_EXT_CON.PWM_5: RN5.13 ; port DRV_EXT_CON.PWM_5
DRV_EXT_CON.PWM_6: RN5.14 ; port DRV_EXT_CON.PWM_6
DRV_EXT_CON.PWM_7: RN5.15 ; port DRV_EXT_CON.PWM_7
DRV_EXT_CON.PWM_8: RN5.16 ; port DRV_EXT_CON.PWM_8
DRV_EXT_CON.READY_DRV_1: RN3.10 ; port DRV_EXT_CON.READY_DRV_1
DRV_EXT_CON.READY_DRV_2: RN3.11 ; port DRV_EXT_CON.READY_DRV_2
DRV_EXT_CON.READY_DRV_3: RN3.12 ; port DRV_EXT_CON.READY_DRV_3
DRV_EXT_CON.READY_DRV_4: RN3.13 ; port DRV_EXT_CON.READY_DRV_4
DRV_EXT_CON.READY_DRV_5: RN3.14 ; port DRV_EXT_CON.READY_DRV_5
DRV_EXT_CON.READY_DRV_6: RN3.15 ; port DRV_EXT_CON.READY_DRV_6
DRV_EXT_CON.READY_DRV_7: RN3.16 ; port DRV_EXT_CON.READY_DRV_7
DRV_EXT_CON.READY_DRV_8: RN4.9 ; port DRV_EXT_CON.READY_DRV_8
FPGA_EXT.ENABLE_DRV: D5.3 RN3.8 ; port FPGA_EXT.ENABLE_DRV
FPGA_EXT.ENC_A1: D2.3 RN1.1 ; port FPGA_EXT.ENC_A1
FPGA_EXT.ENC_A2: D2.1 RN1.3 ; port FPGA_EXT.ENC_A2
FPGA_EXT.ENC_A3: D1.3 RN1.5 ; port FPGA_EXT.ENC_A3
FPGA_EXT.ENC_A4: D1.1 RN1.7 ; port FPGA_EXT.ENC_A4
FPGA_EXT.ENC_A5: D4.3 RN2.1 ; port FPGA_EXT.ENC_A5
FPGA_EXT.ENC_A6: D4.1 RN2.3 ; port FPGA_EXT.ENC_A6
FPGA_EXT.ENC_A7: D3.3 RN2.5 ; port FPGA_EXT.ENC_A7
FPGA_EXT.ENC_A8: D3.1 RN2.7 ; port FPGA_EXT.ENC_A8
FPGA_EXT.ENC_B1: D2.4 RN1.2 ; port FPGA_EXT.ENC_B1
FPGA_EXT.ENC_B2: D2.6 RN1.4 ; port FPGA_EXT.ENC_B2
FPGA_EXT.ENC_B3: D1.4 RN1.6 ; port FPGA_EXT.ENC_B3
FPGA_EXT.ENC_B4: D1.6 RN1.8 ; port FPGA_EXT.ENC_B4
FPGA_EXT.ENC_B5: D4.4 RN2.2 ; port FPGA_EXT.ENC_B5
FPGA_EXT.ENC_B6: D4.6 RN2.4 ; port FPGA_EXT.ENC_B6
FPGA_EXT.ENC_B7: D3.4 RN2.6 ; port FPGA_EXT.ENC_B7
FPGA_EXT.ENC_B8: D3.6 RN2.8 ; port FPGA_EXT.ENC_B8
FPGA_EXT.IO_1: D11.3 RN6.1 ; port FPGA_EXT.IO_1
FPGA_EXT.IO_2: D11.4 RN6.2 ; port FPGA_EXT.IO_2
FPGA_EXT.IO_3: D11.1 RN6.3 ; port FPGA_EXT.IO_3
FPGA_EXT.IO_4: D11.6 RN6.4 ; port FPGA_EXT.IO_4
FPGA_EXT.IO_5: D10.3 RN6.5 ; port FPGA_EXT.IO_5
FPGA_EXT.IO_6: D10.4 RN6.6 ; port FPGA_EXT.IO_6
FPGA_EXT.IO_7: D10.1 RN6.7 ; port FPGA_EXT.IO_7
FPGA_EXT.IO_8: D10.6 RN6.8 ; port FPGA_EXT.IO_8
FPGA_EXT.PWM_1: D8.6 RN5.8 ; port FPGA_EXT.PWM_1
FPGA_EXT.PWM_2: D8.1 RN5.7 ; port FPGA_EXT.PWM_2
FPGA_EXT.PWM_3: D8.4 RN5.6 ; port FPGA_EXT.PWM_3
FPGA_EXT.PWM_4: D8.3 RN5.5 ; port FPGA_EXT.PWM_4
FPGA_EXT.PWM_5: D9.6 RN5.4 ; port FPGA_EXT.PWM_5
FPGA_EXT.PWM_6: D9.1 RN5.3 ; port FPGA_EXT.PWM_6
FPGA_EXT.PWM_7: D9.4 RN5.2 ; port FPGA_EXT.PWM_7
FPGA_EXT.PWM_8: D9.3 RN5.1 ; port FPGA_EXT.PWM_8
FPGA_EXT.READY_DRV_1: D5.4 RN3.7 ; port FPGA_EXT.READY_DRV_1
FPGA_EXT.READY_DRV_2: D5.1 RN3.6 ; port FPGA_EXT.READY_DRV_2
FPGA_EXT.READY_DRV_3: D5.6 RN3.5 ; port FPGA_EXT.READY_DRV_3
FPGA_EXT.READY_DRV_4: D6.4 RN3.4 ; port FPGA_EXT.READY_DRV_4
FPGA_EXT.READY_DRV_5: D6.6 RN3.3 ; port FPGA_EXT.READY_DRV_5
FPGA_EXT.READY_DRV_6: D6.1 RN3.2 ; port FPGA_EXT.READY_DRV_6
FPGA_EXT.READY_DRV_7: D6.3 RN3.1 ; port FPGA_EXT.READY_DRV_7
FPGA_EXT.READY_DRV_8: D7.6 RN4.8 ; port FPGA_EXT.READY_DRV_8

Not connected (* = marked no-connect by the designer): D7 1 3 4; RN4 1 2 3 4 5 6 7 10 11 12 13 14 15 16

### Notes on the sheet
- (near D11) Text
- Title:
- Description:
- Size:
- Date:
- Name:
- Number:
- Time:
- Revision:
- Sheet
- Checked:
- of
- File:

## Sheet PATHOS_FPGA_MemoryInterface.SchDoc: FPGA SOM Memory Interface
size A4; Author: A. Kalberer; CompanyName: NTB; Organization: NTB Interstate University of Applied; Address1: Werdenbergstrasse 4; Address3: 9471 Buchs; Address4: Switzerland; Organization1: Sciences of Technology Buchs; Size: A4
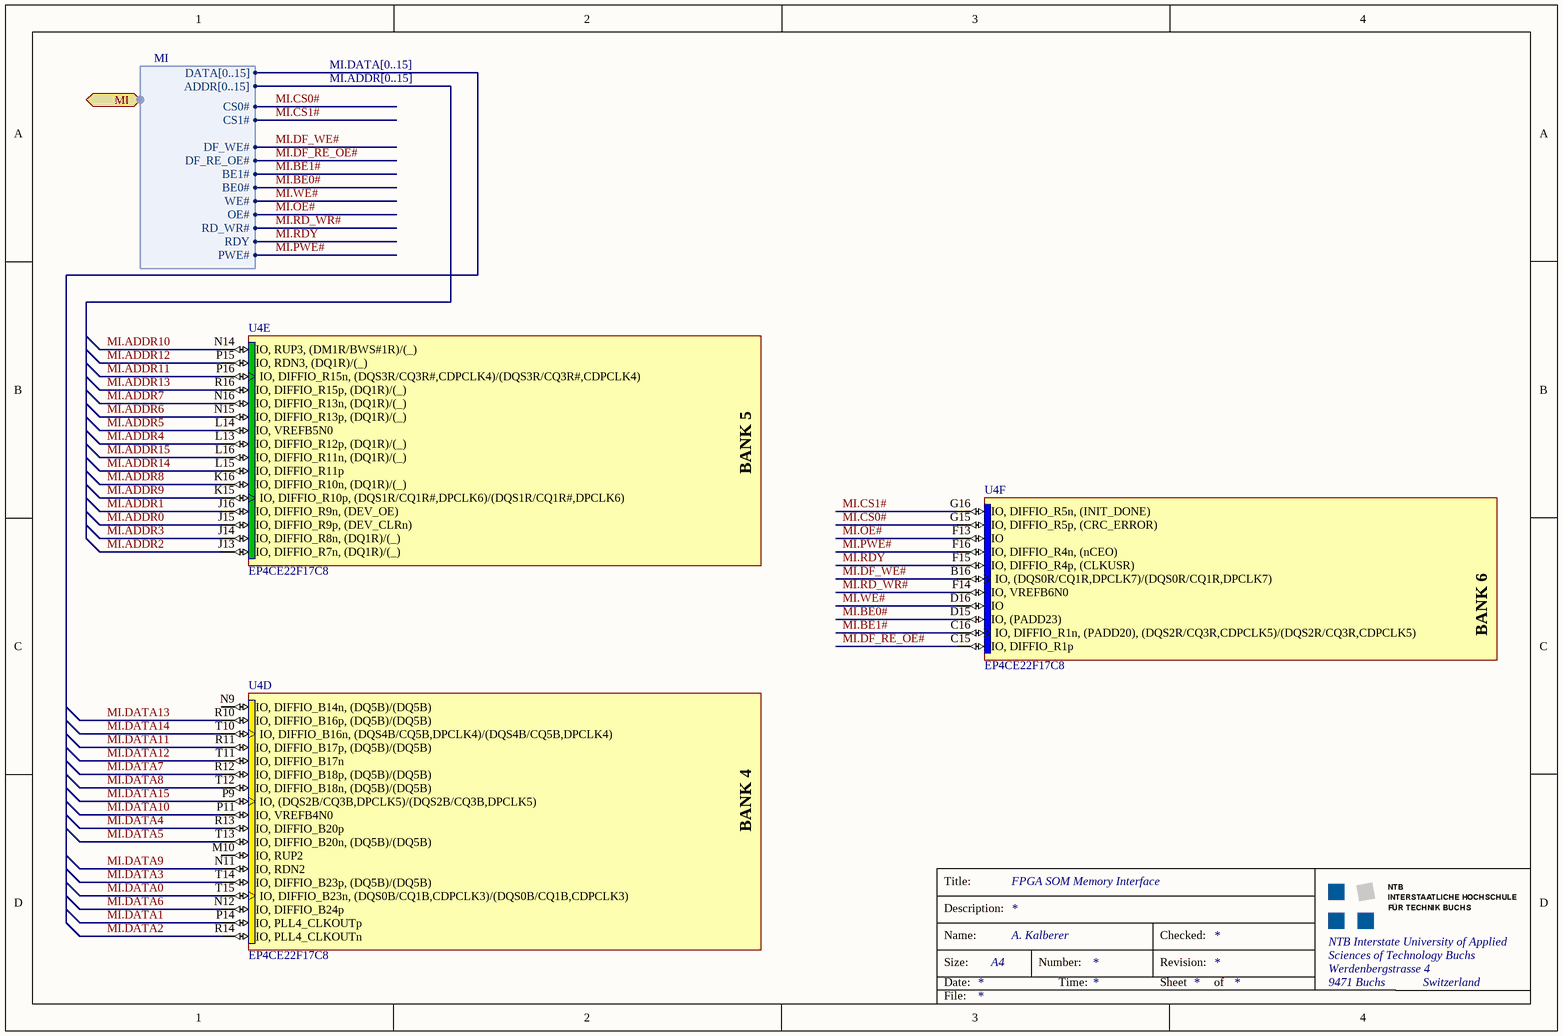
[diagram p6: PATHOS_FPGA_MemoryInterface.SchDoc]

### Parts
U4  EP4CE22F17C8  [FBGA256]  (parts D,E,F of 13)

### Ports
MI (harness MI)

### Harnesses
MI: DATA[0..15], ADDR[0..15], CS0#, DF_WE#, DF_RE_OE#, BE1#, BE0#, WE#, OE#, RD_WR#, RDY, PWE#, CS1#

### Nets
MI.ADDR0: U4.J15(IO,_DIFFIO_R9p,_(DEV_CLRn))
MI.ADDR1: U4.J16(IO,_DIFFIO_R9n,_(DEV_OE))
MI.ADDR2: U4.J13(IO,_DIFFIO_R7n,_(DQ1R)/(_))
MI.ADDR3: U4.J14(IO,_DIFFIO_R8n,_(DQ1R)/(_))
MI.ADDR4: U4.L13(IO,_DIFFIO_R12p,_(DQ1R)/(_))
MI.ADDR5: U4.L14(IO,_VREFB5N0)
MI.ADDR6: U4.N15(IO,_DIFFIO_R13p,_(DQ1R)/(_))
MI.ADDR7: U4.N16(IO,_DIFFIO_R13n,_(DQ1R)/(_))
MI.ADDR8: U4.K16(IO,_DIFFIO_R10n,_(DQ1R)/(_))
MI.ADDR9: U4.K15(IO,_DIFFIO_R10p,_(DQS1R/CQ1R#,DPCLK6)/(DQS1R/CQ1R#,DPCLK6))
MI.ADDR10: U4.N14(IO,_RUP3,_(DM1R/BWS#1R)/(_))
MI.ADDR11: U4.P16(IO,_DIFFIO_R15n,_(DQS3R/CQ3R#,CDPCLK4)/(DQS3R/CQ3R#,CDPCLK4))
MI.ADDR12: U4.P15(IO,_RDN3,_(DQ1R)/(_))
MI.ADDR13: U4.R16(IO,_DIFFIO_R15p,_(DQ1R)/(_))
MI.ADDR14: U4.L15(IO,_DIFFIO_R11p)
MI.ADDR15: U4.L16(IO,_DIFFIO_R11n,_(DQ1R)/(_))
MI.BE0#: U4.D15(IO,_(PADD23)) ; port MI.BE0#
MI.BE1#: U4.C16(IO,_DIFFIO_R1n,_(PADD20),_(DQS2R/CQ3R,CDPCLK5)/(DQS2R/CQ3R,CDPCLK5)) ; port MI.BE1#
MI.CS0#: U4.G15(IO,_DIFFIO_R5p,_(CRC_ERROR)) ; port MI.CS0#
MI.CS1#: U4.G16(IO,_DIFFIO_R5n,_(INIT_DONE)) ; port MI.CS1#
MI.DATA0: U4.T15(IO,_DIFFIO_B23n,_(DQS0B/CQ1B,CDPCLK3)/(DQS0B/CQ1B,CDPCLK3))
MI.DATA1: U4.P14(IO,_PLL4_CLKOUTp)
MI.DATA2: U4.R14(IO,_PLL4_CLKOUTn)
MI.DATA3: U4.T14(IO,_DIFFIO_B23p,_(DQ5B)/(DQ5B))
MI.DATA4: U4.R13(IO,_DIFFIO_B20p)
MI.DATA5: U4.T13(IO,_DIFFIO_B20n,_(DQ5B)/(DQ5B))
MI.DATA6: U4.N12(IO,_DIFFIO_B24p)
MI.DATA7: U4.R12(IO,_DIFFIO_B18p,_(DQ5B)/(DQ5B))
MI.DATA8: U4.T12(IO,_DIFFIO_B18n,_(DQ5B)/(DQ5B))
MI.DATA9: U4.N11(IO,_RDN2)
MI.DATA10: U4.P11(IO,_VREFB4N0)
MI.DATA11: U4.R11(IO,_DIFFIO_B17p,_(DQ5B)/(DQ5B))
MI.DATA12: U4.T11(IO,_DIFFIO_B17n)
MI.DATA13: U4.R10(IO,_DIFFIO_B16p,_(DQ5B)/(DQ5B))
MI.DATA14: U4.T10(IO,_DIFFIO_B16n,_(DQS4B/CQ5B,DPCLK4)/(DQS4B/CQ5B,DPCLK4))
MI.DATA15: U4.P9(IO,_(DQS2B/CQ3B,DPCLK5)/(DQS2B/CQ3B,DPCLK5))
MI.DF_RE_OE#: U4.C15(IO,_DIFFIO_R1p) ; port MI.DF_RE_OE#
MI.DF_WE#: U4.B16(IO,_(DQS0R/CQ1R,DPCLK7)/(DQS0R/CQ1R,DPCLK7)) ; port MI.DF_WE#
MI.OE#: U4.F13(IO) ; port MI.OE#
MI.PWE#: U4.F16(IO,_DIFFIO_R4n,_(nCEO)) ; port MI.PWE#
MI.RD_WR#: U4.F14(IO,_VREFB6N0) ; port MI.RD_WR#
MI.RDY: U4.F15(IO,_DIFFIO_R4p,_(CLKUSR)) ; port MI.RDY
MI.WE#: U4.D16(IO) ; port MI.WE#

Not connected (* = marked no-connect by the designer): U4 M10(IO,_RUP2) N9(IO,_DIFFIO_B14n,_(DQ5B)/(DQ5B))

### Buses and harness runs
bus MI.ADDR[0..15]
bus MI.DATA[0..15]

### Notes on the sheet
- Title:
- Description:
- Size:
- Date:
- Name:
- Number:
- Time:
- Revision:
- Sheet
- Checked:
- of
- File:
- (in symbol EP4CE22F17C8, part D) BANK 4
- (in symbol EP4CE22F17C8, part E) BANK 5
- (in symbol EP4CE22F17C8, part F) BANK 6

### Library data of the parts
U4 = EP4CE22F17C8: as U4 on sheet PATHOS_FPGA_Power; Published: 3-May-2010; DatasheetVersion: ver1.2, Mar-2010; PackageVersion: ver16.0, Dec-2009; PackageReference: FBGA256; Publisher: Altium Limited; PackageDescription: 256-Ball FineLine Ball Grid Array (FBGA256) - Option 1 - Wire Bond; Supplier 1: Digi-Key; Supplier Part Number 1: EP4CE22F17C8-ND; Code_JEDEC: MS-034-AAF-1; Code_IPC: BGA100P16X16-256; ComponentLink1Description: Manufacturer Link; ComponentLink1URL: http://www.altera.com/; ComponentLink2Description: Handbook; ComponentLink2URL: http://www.altera.com/literature/hb/cyclone-iv/cyclone4-handbook.pdf; ComponentLink3Description: Pinout Specification; ComponentLink3URL: http://www.altera.com/literature/lit-dp.jsp?category=cyc%204&showspreadsheet=y; ComponentLink4Description: Packaging Specification; ComponentLink4URL: http://www.altera.com/literature/ds/dspkg.pdf

## Sheet PATHOS_SOM.SchDoc: SOM Main Schematic
size A4; Author: A. Kalberer; CompanyName: NTB; Organization: NTB Interstate University of Applied; Address1: Werdenbergstrasse 4; Address3: 9471 Buchs; Address4: Switzerland; Organization1: Sciences of Technology Buchs; Size: A4
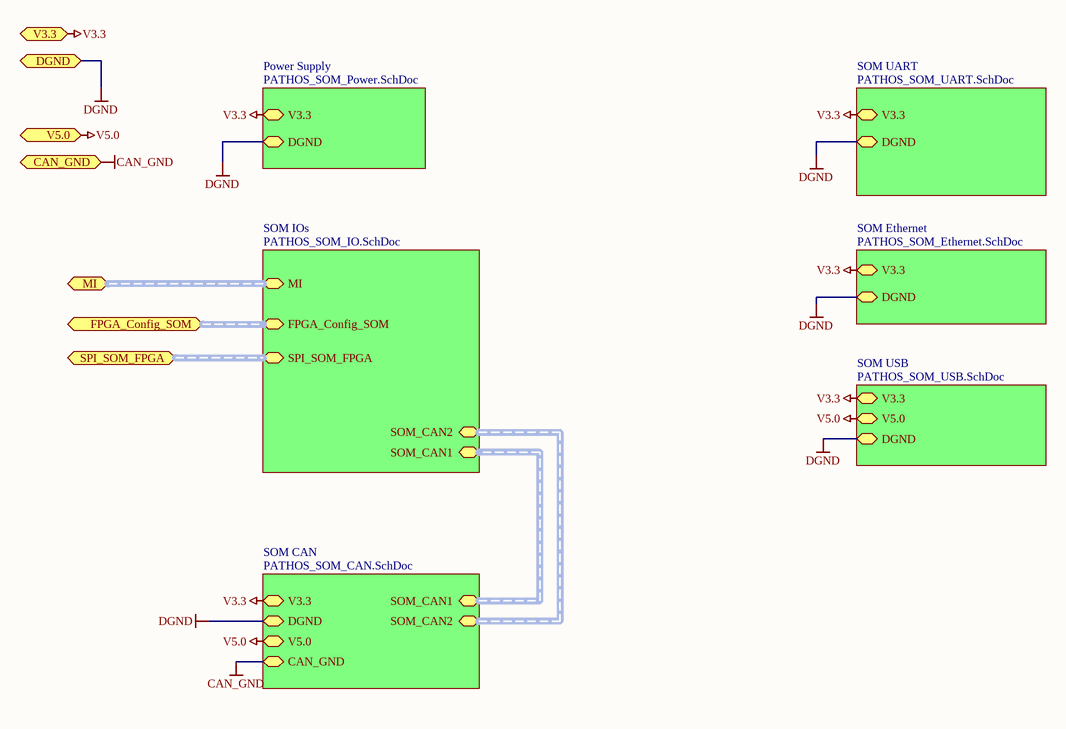
[diagram p7: PATHOS_SOM.SchDoc]

### Sub-sheets
Power Supply = PATHOS_SOM_Power.SchDoc: V3.3, DGND
SOM CAN = PATHOS_SOM_CAN.SchDoc: V3.3, DGND, V5.0, CAN_GND, SOM_CAN1 (harness SOM_CAN1), SOM_CAN2 (harness SOM_CAN2)
SOM Ethernet = PATHOS_SOM_Ethernet.SchDoc: DGND, V3.3
SOM IOs = PATHOS_SOM_IO.SchDoc: MI (harness MI), FPGA_Config_SOM (harness FPGA_Config_SOM), SPI_SOM_FPGA (harness SPI_SOM_FPGA), SOM_CAN1 (harness SOM_CAN1), SOM_CAN2 (harness SOM_CAN2)
SOM UART = PATHOS_SOM_UART.SchDoc: V3.3, DGND
SOM USB = PATHOS_SOM_USB.SchDoc (file not in this document): V3.3, V5.0, DGND

### Ports
CAN_GND, DGND, FPGA_Config_SOM (harness FPGA_Config_SOM), MI (harness MI), SPI_SOM_FPGA (harness SPI_SOM_FPGA), V3.3, V5.0

### Nets
CAN_GND: port CAN_GND, sheet SOM CAN/CAN_GND
DGND: port DGND, sheet Power Supply/DGND, sheet SOM UART/DGND, sheet SOM Ethernet/DGND, sheet SOM CAN/DGND, sheet SOM USB/DGND
V3.3: port V3.3, sheet Power Supply/V3.3, sheet SOM UART/V3.3, sheet SOM Ethernet/V3.3, sheet SOM CAN/V3.3, sheet SOM USB/V3.3
V5.0: port V5.0, sheet SOM CAN/V5.0, sheet SOM USB/V5.0

### Buses and harness runs
harness port FPGA_Config_SOM = sheet SOM IOs/FPGA_Config_SOM
harness port MI = sheet SOM IOs/MI
harness port SPI_SOM_FPGA = sheet SOM IOs/SPI_SOM_FPGA
harness sheet SOM CAN/SOM_CAN1 = sheet SOM IOs/SOM_CAN1
harness sheet SOM CAN/SOM_CAN2 = sheet SOM IOs/SOM_CAN2

### Notes on the sheet
- Title:
- Description:
- Size:
- Date:
- Name:
- Number:
- Time:
- Revision:
- Sheet
- Checked:
- of
- File:

## Sheet PATHOS_SOM_Power.SchDoc: SOM Power Supply
size A4; Author: A. Kalberer; CompanyName: NTB; Organization: NTB Interstate University of Applied; Address1: Werdenbergstrasse 4; Address3: 9471 Buchs; Address4: Switzerland; Revision: 0.1; Organization1: Sciences of Technology Buchs; Size: A4
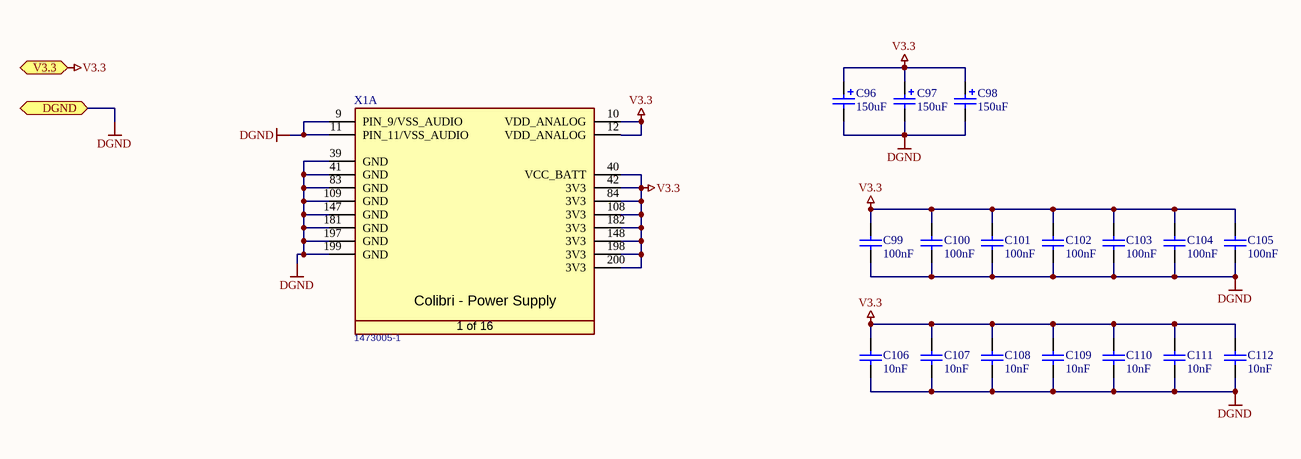
[diagram p8: PATHOS_SOM_Power.SchDoc]

### Parts
C96  150uF  [ChipC_7343-40]
C97  150uF  [ChipC_7343-40]
C98  150uF  [ChipC_7343-40]
C99  100nF  [0603_3D]
C100  100nF  [0603_3D]
C101  100nF  [0603_3D]
C102  100nF  [0603_3D]
C103  100nF  [0603_3D]
C104  100nF  [0603_3D]
C105  100nF  [0603_3D]
C106  10nF  [0603_3D]
C107  10nF  [0603_3D]
C108  10nF  [0603_3D]
C109  10nF  [0603_3D]
C110  10nF  [0603_3D]
C111  10nF  [0603_3D]
C112  10nF  [0603_3D]
X1  Manufacturer Part No.: 1473005-1  [T_Tyco_1473005-1]  (hidden comment: CON-Tyco-1473005-1-200-0.6mm)  (part A of 16)

### Ports
DGND, V3.3

### Nets
DGND: C96.2(Neg) C97.2(Neg) C98.2(Neg) C99.1 C100.1 C101.1 C102.1 C103.1 C104.1 C105.1 C106.1 C107.1 C108.1 C109.1 C110.1 C111.1 C112.1 X1.9(PIN_9/VSS_AUDIO) X1.11(PIN_11/VSS_AUDIO) X1.39(GND) X1.41(GND) X1.83(GND) X1.109(GND) X1.147(GND) X1.181(GND) X1.197(GND) X1.199(GND) ; port DGND
V3.3: C96.1(Pos) C97.1(Pos) C98.1(Pos) C99.2 C100.2 C101.2 C102.2 C103.2 C104.2 C105.2 C106.2 C107.2 C108.2 C109.2 C110.2 C111.2 C112.2 X1.10(VDD_ANALOG) X1.12(VDD_ANALOG) X1.40(VCC_BATT) X1.42(3V3) X1.84(3V3) X1.108(3V3) X1.148(3V3) X1.182(3V3) X1.198(3V3) X1.200(3V3) ; port V3.3

### Notes on the sheet
- Title:
- Description:
- Size:
- Date:
- Name:
- Number:
- Time:
- Revision:
- Sheet
- Checked:
- of
- File:
- (in symbol CON-Tyco-1473005-1-200-0.6mm, part A) Colibri - Power Supply; 1 of 16

### Library data of the parts
C96-C98 = C_POL: Polarized Capacitor Positive Mark Bar; #Manufacturer: Generic Components; #Publisher: Dr. A. Heinzelmann; #Class: Passive; Initial Voltage: 0V; Type: Tantal; #Published: 2006-10-07; #ClassSub: Capacitor; Voltage Maxium: *; Value: 150uF
C99-C112 = C: as C13 on sheet PATHOS_FPGA_Power; #Published: 2006-10-07; #ClassSub: Capacitor; Type: *; Voltage Maximum: *
  C99-C105: Value: 100nF
  C106-C112: Value: 10nF
X1 = CON-Tyco-1473005-1-200-0.6mm: SODIMM Connector; Manufacturer Name: Tyco; No. of ways: 200

## Sheet PATHOS_SOM_IO.SchDoc: EFS SOM IO
size A3; Author: A. Kalberer; CompanyName: NTB; Organization: NTB Interstate University of Applied; Address1: Werdenbergstrasse 4; Address3: 9471 Buchs; Address4: Switzerland; Organization1: Sciences of Technology Buchs; Size: A3; ShortDescription: SOM GMI-Bus, FPGA Config
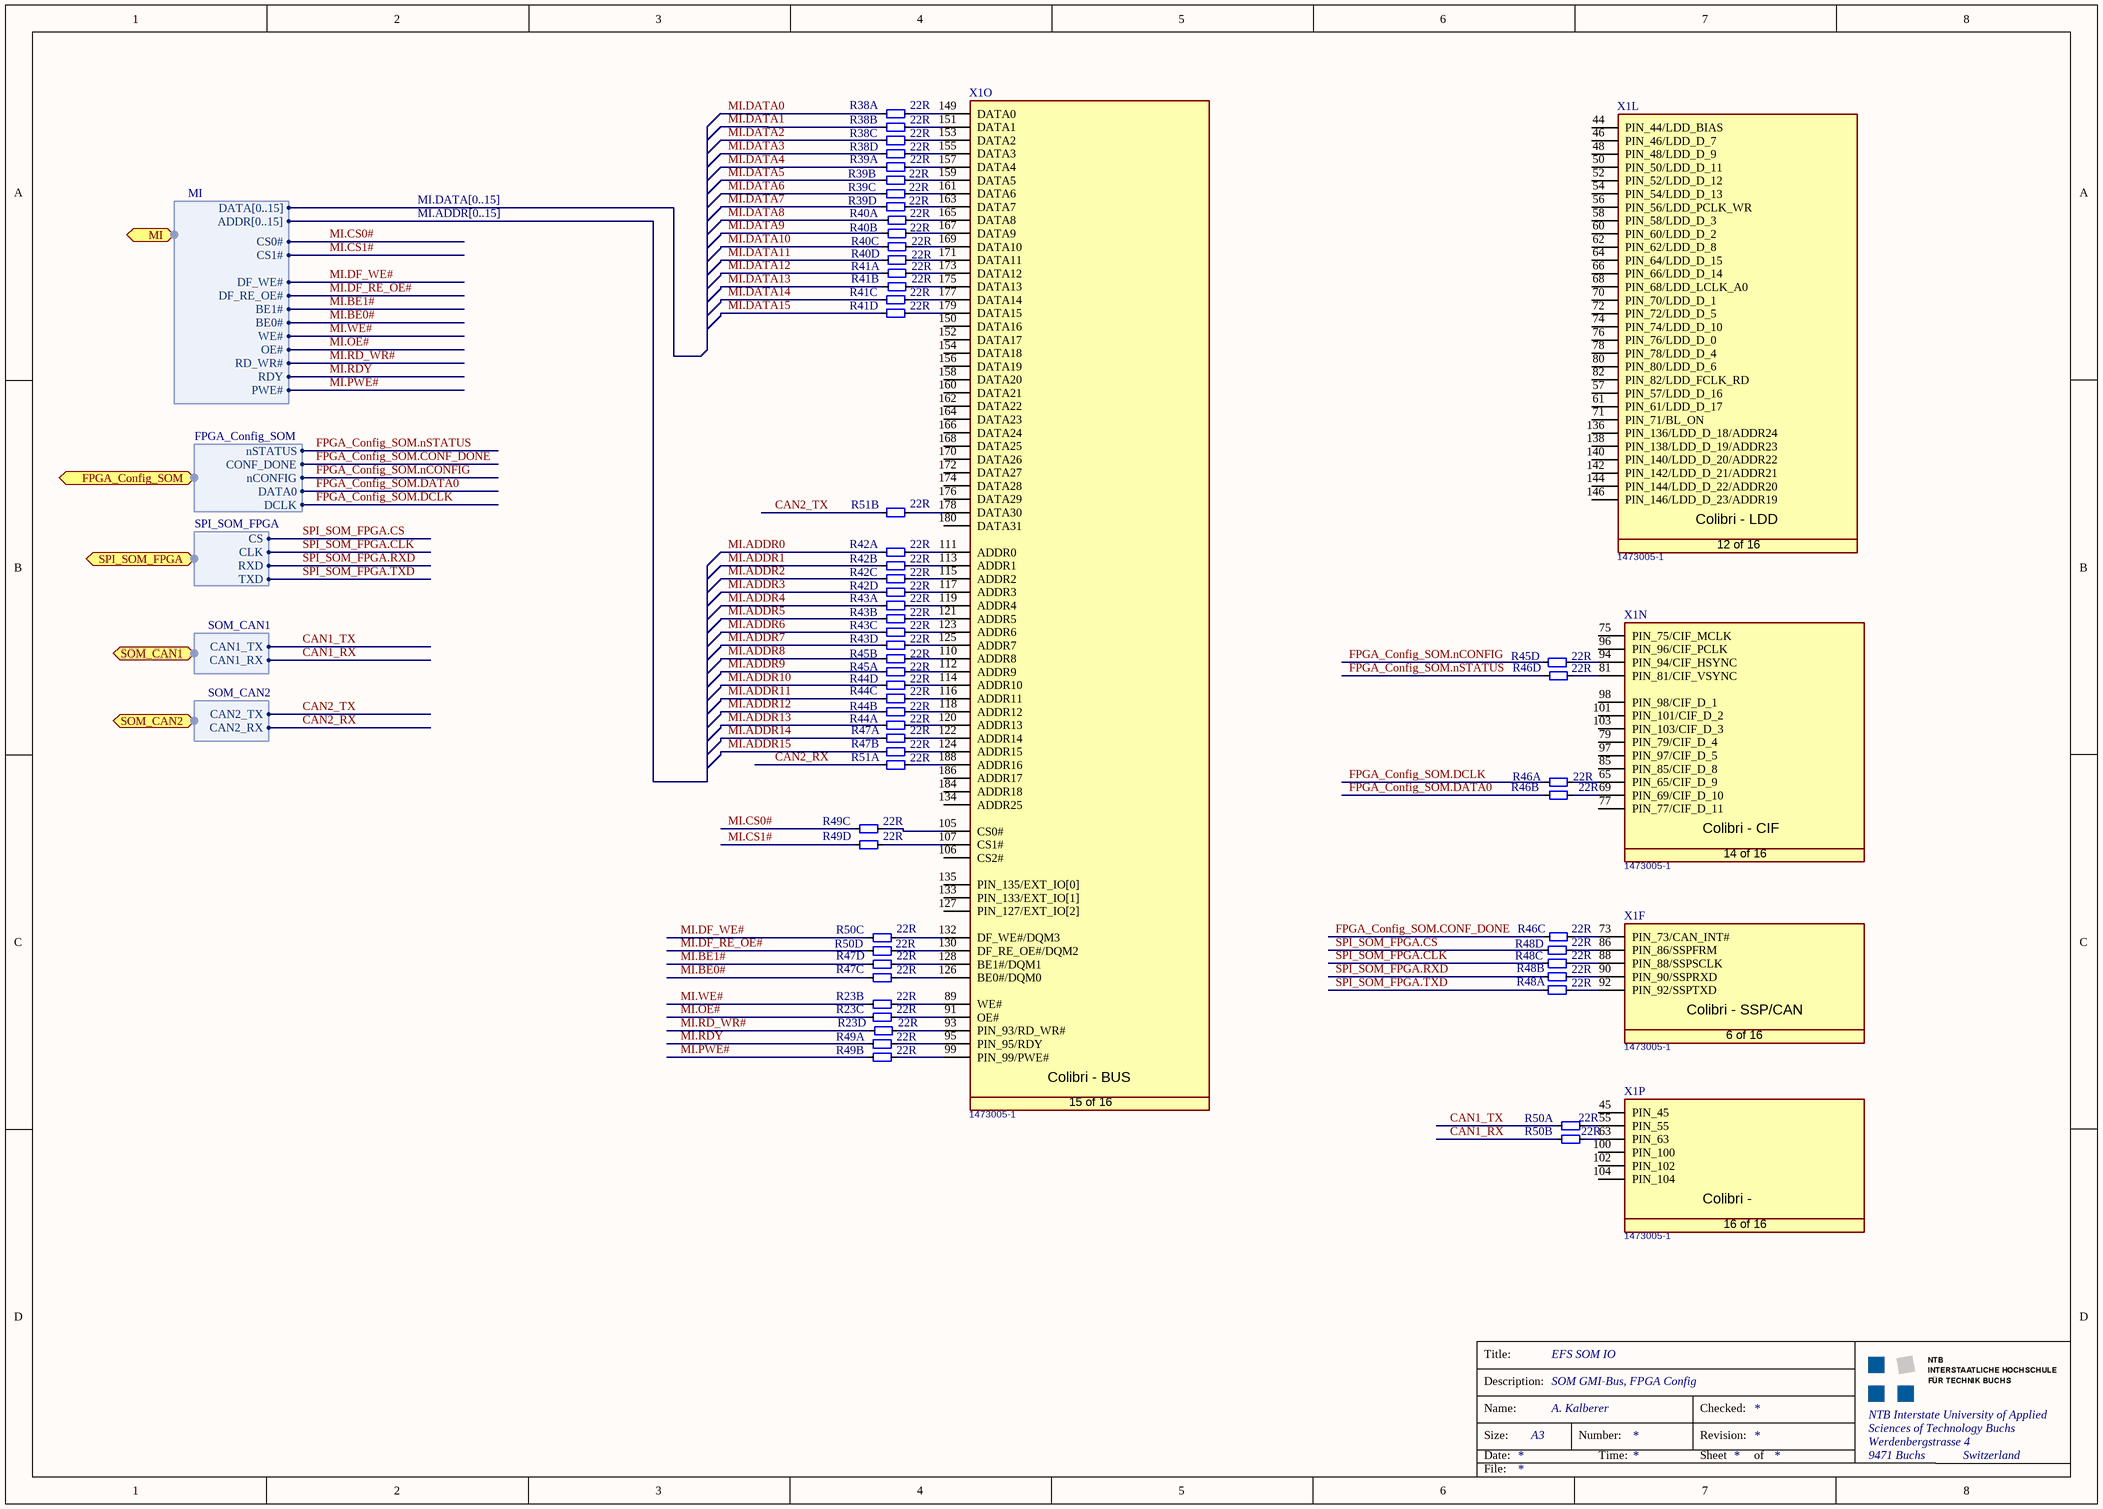
[diagram p9: PATHOS_SOM_IO.SchDoc]

### Parts
R23  value 22R  [R_Array_CAT16-J4]  (hidden comment: R Array)  (parts B,C,D of 4)
R38  value 22R  [R_Array_CAT16-J4]  (hidden comment: R Array)  (parts A,B,C,D of 4)
R39  value 22R  [R_Array_CAT16-J4]  (hidden comment: R Array)  (parts A,B,C,D of 4)
R40  value 22R  [R_Array_CAT16-J4]  (hidden comment: R Array)  (parts A,B,C,D of 4)
R41  value 22R  [R_Array_CAT16-J4]  (hidden comment: R Array)  (parts A,B,C,D of 4)
R42  value 22R  [R_Array_CAT16-J4]  (hidden comment: R Array)  (parts A,B,C,D of 4)
R43  value 22R  [R_Array_CAT16-J4]  (hidden comment: R Array)  (parts A,B,C,D of 4)
R44  value 22R  [R_Array_CAT16-J4]  (hidden comment: R Array)  (parts A,B,C,D of 4)
R45  value 22R  [R_Array_CAT16-J4]  (hidden comment: R Array)  (parts A,B,D of 4)
R46  value 22R  [R_Array_CAT16-J4]  (hidden comment: R Array)  (parts A,B,C,D of 4)
R47  value 22R  [R_Array_CAT16-J4]  (hidden comment: R Array)  (parts A,B,C,D of 4)
R48  value 22R  [R_Array_CAT16-J4]  (hidden comment: R Array)  (parts A,B,C,D of 4)
R49  value 22R  [R_Array_CAT16-J4]  (hidden comment: R Array)  (parts A,B,C,D of 4)
R50  value 22R  [R_Array_CAT16-J4]  (hidden comment: R Array)  (parts A,B,C,D of 4)
R51  value 22R  [R_Array_CAT16-J4]  (hidden comment: R Array)  (parts A,B of 4)
X1  Manufacturer Part No.: 1473005-1  [T_Tyco_1473005-1]  (hidden comment: CON-Tyco-1473005-1-200-0.6mm)  (parts F,L,N,O,P of 16)

### Ports
FPGA_Config_SOM (harness FPGA_Config_SOM), MI (harness MI), SOM_CAN1 (harness SOM_CAN1), SOM_CAN2 (harness SOM_CAN2), SPI_SOM_FPGA (harness SPI_SOM_FPGA)

### Harnesses
MI: DATA[0..15], ADDR[0..15], CS0#, DF_WE#, DF_RE_OE#, BE1#, BE0#, WE#, OE#, RD_WR#, RDY, PWE#, CS1#
FPGA_Config_SOM: DCLK, DATA0, nCONFIG, CONF_DONE, nSTATUS
SPI_SOM_FPGA: CS, CLK, RXD, TXD
SOM_CAN1: CAN1_TX, CAN1_RX
SOM_CAN2: CAN2_TX, CAN2_RX

### Nets
CAN1_RX: R50.2B ; port SOM_CAN1.CAN1_RX
CAN1_TX: R50.2A ; port SOM_CAN1.CAN1_TX
CAN2_RX: R51.1A ; port SOM_CAN2.CAN2_RX
CAN2_TX: R51.1B ; port SOM_CAN2.CAN2_TX
FPGA_Config_SOM.CONF_DONE: R46.1C ; port FPGA_Config_SOM.CONF_DONE
FPGA_Config_SOM.DATA0: R46.1B ; port FPGA_Config_SOM.DATA0
FPGA_Config_SOM.DCLK: R46.1A ; port FPGA_Config_SOM.DCLK
FPGA_Config_SOM.nCONFIG: R45.1D ; port FPGA_Config_SOM.nCONFIG
FPGA_Config_SOM.nSTATUS: R46.1D ; port FPGA_Config_SOM.nSTATUS
MI.ADDR0: R42.1A
MI.ADDR1: R42.1B
MI.ADDR2: R42.1C
MI.ADDR3: R42.1D
MI.ADDR4: R43.1A
MI.ADDR5: R43.1B
MI.ADDR6: R43.1C
MI.ADDR7: R43.1D
MI.ADDR8: R45.1B
MI.ADDR9: R45.1A
MI.ADDR10: R44.1D
MI.ADDR11: R44.1C
MI.ADDR12: R44.1B
MI.ADDR13: R44.1A
MI.ADDR14: R47.1A
MI.ADDR15: R47.1B
MI.BE0#: R47.1C ; port MI.BE0#
MI.BE1#: R47.1D ; port MI.BE1#
MI.CS0#: R49.1C ; port MI.CS0#
MI.CS1#: R49.1D ; port MI.CS1#
MI.DATA0: R38.1A
MI.DATA1: R38.1B
MI.DATA2: R38.1C
MI.DATA3: R38.1D
MI.DATA4: R39.1A
MI.DATA5: R39.1B
MI.DATA6: R39.1C
MI.DATA7: R39.1D
MI.DATA8: R40.1A
MI.DATA9: R40.1B
MI.DATA10: R40.1C
MI.DATA11: R40.1D
MI.DATA12: R41.1A
MI.DATA13: R41.1B
MI.DATA14: R41.1C
MI.DATA15: R41.1D
MI.DF_RE_OE#: R50.1D ; port MI.DF_RE_OE#
MI.DF_WE#: R50.1C ; port MI.DF_WE#
MI.OE#: R23.1C ; port MI.OE#
MI.PWE#: R49.1B ; port MI.PWE#
MI.RD_WR#: R23.1D ; port MI.RD_WR#
MI.RDY: R49.1A ; port MI.RDY
MI.WE#: R23.1B ; port MI.WE#
SPI_SOM_FPGA.CLK: R48.1C ; port SPI_SOM_FPGA.CLK
SPI_SOM_FPGA.CS: R48.1D ; port SPI_SOM_FPGA.CS
SPI_SOM_FPGA.RXD: R48.1B ; port SPI_SOM_FPGA.RXD
SPI_SOM_FPGA.TXD: R48.1A ; port SPI_SOM_FPGA.TXD
NetR23_2B: R23.2B X1.89(WE#)
NetR23_2C: R23.2C X1.91(OE#)
NetR23_2D: R23.2D X1.93(PIN_93/RD_WR#)
NetR38_2A: R38.2A X1.149(DATA0)
NetR38_2B: R38.2B X1.151(DATA1)
NetR38_2C: R38.2C X1.153(DATA2)
NetR38_2D: R38.2D X1.155(DATA3)
NetR39_2A: R39.2A X1.157(DATA4)
NetR39_2B: R39.2B X1.159(DATA5)
NetR39_2C: R39.2C X1.161(DATA6)
NetR39_2D: R39.2D X1.163(DATA7)
NetR40_2A: R40.2A X1.165(DATA8)
NetR40_2B: R40.2B X1.167(DATA9)
NetR40_2C: R40.2C X1.169(DATA10)
NetR40_2D: R40.2D X1.171(DATA11)
NetR41_2A: R41.2A X1.173(DATA12)
NetR41_2B: R41.2B X1.175(DATA13)
NetR41_2C: R41.2C X1.177(DATA14)
NetR41_2D: R41.2D X1.179(DATA15)
NetR42_2A: R42.2A X1.111(ADDR0)
NetR42_2B: R42.2B X1.113(ADDR1)
NetR42_2C: R42.2C X1.115(ADDR2)
NetR42_2D: R42.2D X1.117(ADDR3)
NetR43_2A: R43.2A X1.119(ADDR4)
NetR43_2B: R43.2B X1.121(ADDR5)
NetR43_2C: R43.2C X1.123(ADDR6)
NetR43_2D: R43.2D X1.125(ADDR7)
NetR44_2A: R44.2A X1.120(ADDR13)
NetR44_2B: R44.2B X1.118(ADDR12)
NetR44_2C: R44.2C X1.116(ADDR11)
NetR44_2D: R44.2D X1.114(ADDR10)
NetR45_2A: R45.2A X1.112(ADDR9)
NetR45_2B: R45.2B X1.110(ADDR8)
NetR45_2D: R45.2D X1.94(PIN_94/CIF_HSYNC)
NetR46_2A: R46.2A X1.65(PIN_65/CIF_D_9)
NetR46_2B: R46.2B X1.69(PIN_69/CIF_D_10)
NetR46_2C: R46.2C X1.73(PIN_73/CAN_INT#)
NetR46_2D: R46.2D X1.81(PIN_81/CIF_VSYNC)
NetR47_2A: R47.2A X1.122(ADDR14)
NetR47_2B: R47.2B X1.124(ADDR15)
NetR47_2C: R47.2C X1.126(BE0#/DQM0)
NetR47_2D: R47.2D X1.128(BE1#/DQM1)
NetR48_2A: R48.2A X1.92(PIN_92/SSPTXD)
NetR48_2B: R48.2B X1.90(PIN_90/SSPRXD)
NetR48_2C: R48.2C X1.88(PIN_88/SSPSCLK)
NetR48_2D: R48.2D X1.86(PIN_86/SSPFRM)
NetR49_2A: R49.2A X1.95(PIN_95/RDY)
NetR49_2B: R49.2B X1.99(PIN_99/PWE#)
NetR49_2C: R49.2C X1.105(CS0#)
NetR49_2D: R49.2D X1.107(CS1#)
NetR50_1A: R50.1A X1.55(PIN_55)
NetR50_1B: R50.1B X1.63(PIN_63)
NetR50_2C: R50.2C X1.132(DF_WE#/DQM3)
NetR50_2D: R50.2D X1.130(DF_RE_OE#/DQM2)
NetR51_2A: R51.2A X1.188(ADDR16)
NetR51_2B: R51.2B X1.178(DATA30)

Not connected (* = marked no-connect by the designer): X1 44(PIN_44/LDD_BIAS) 45(PIN_45) 46(PIN_46/LDD_D_7) 48(PIN_48/LDD_D_9) 50(PIN_50/LDD_D_11) 52(PIN_52/LDD_D_12) 54(PIN_54/LDD_D_13) 56(PIN_56/LDD_PCLK_WR) 57(PIN_57/LDD_D_16) 58(PIN_58/LDD_D_3) 60(PIN_60/LDD_D_2) 61(PIN_61/LDD_D_17) 62(PIN_62/LDD_D_8) 64(PIN_64/LDD_D_15) 66(PIN_66/LDD_D_14) 68(PIN_68/LDD_LCLK_A0) 70(PIN_70/LDD_D_1) 71(PIN_71/BL_ON) 72(PIN_72/LDD_D_5) 74(PIN_74/LDD_D_10) 75(PIN_75/CIF_MCLK) 76(PIN_76/LDD_D_0) 77(PIN_77/CIF_D_11) 78(PIN_78/LDD_D_4) 79(PIN_79/CIF_D_4) 80(PIN_80/LDD_D_6) 82(PIN_82/LDD_FCLK_RD) 85(PIN_85/CIF_D_8) 96(PIN_96/CIF_PCLK) 97(PIN_97/CIF_D_5) 98(PIN_98/CIF_D_1) 100(PIN_100) 101(PIN_101/CIF_D_2) 102(PIN_102) 103(PIN_103/CIF_D_3) 104(PIN_104) 106(CS2#) 127(PIN_127/EXT_IO[2]) 133(PIN_133/EXT_IO[1]) 134(ADDR25) 135(PIN_135/EXT_IO[0]) 136(PIN_136/LDD_D_18/ADDR24) 138(PIN_138/LDD_D_19/ADDR23) 140(PIN_140/LDD_D_20/ADDR22) 142(PIN_142/LDD_D_21/ADDR21) 144(PIN_144/LDD_D_22/ADDR20) 146(PIN_146/LDD_D_23/ADDR19) 150(DATA16) 152(DATA17) 154(DATA18) 156(DATA19) 158(DATA20) 160(DATA21) 162(DATA22) 164(DATA23) 166(DATA24) 168(DATA25) 170(DATA26) 172(DATA27) 174(DATA28) 176(DATA29) 180(DATA31) 184(ADDR18) 186(ADDR17)

### Buses and harness runs
bus MI.ADDR[0..15]
bus MI.DATA[0..15]

### Notes on the sheet
- Title:
- Description:
- Size:
- Date:
- Name:
- Number:
- Time:
- Revision:
- Sheet
- Checked:
- of
- File:
- (in symbol CON-Tyco-1473005-1-200-0.6mm, part F) Colibri - SSP/CAN; 6 of 16
- (in symbol CON-Tyco-1473005-1-200-0.6mm, part L) Colibri - LDD; 12 of 16
- (in symbol CON-Tyco-1473005-1-200-0.6mm, part N) Colibri - CIF; 14 of 16
- (in symbol CON-Tyco-1473005-1-200-0.6mm, part O) Colibri - BUS; 15 of 16
- (in symbol CON-Tyco-1473005-1-200-0.6mm, part P) Colibri -; 16 of 16

### Library data of the parts
R23 R38-R51 = R_Array
X1 = CON-Tyco-1473005-1-200-0.6mm: as X1 on sheet PATHOS_SOM_Power

## Sheet PATHOS_SOM_UART.SchDoc: UART Connectors
size A4; Author: A. Kalberer; CompanyName: NTB; Organization: NTB Interstate University of Applied; Address1: Werdenbergstrasse 4; Address3: 9471 Buchs; Address4: Switzerland; Organization1: Sciences of Technology Buchs; Size: A4
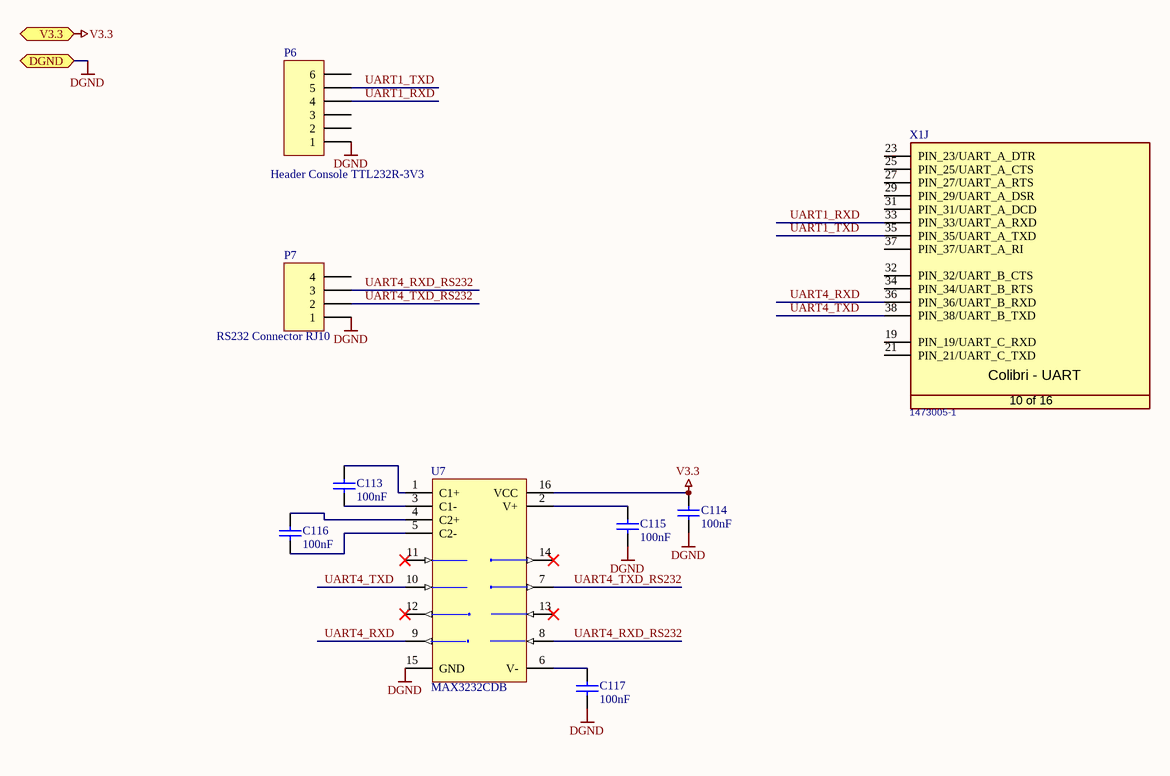
[diagram p10: PATHOS_SOM_UART.SchDoc]

### Parts
C113  100nF  [0603_3D]
C114  100nF  [0603_3D]
C115  100nF  [0603_3D]
C116  100nF  [0603_3D]
C117  100nF  [0603_3D]
P6  Header Console TTL232R-3V3  [Header - 1x6 - V]
P7  RS232 Connector RJ10  [95009-2447]
U7  MAX3232CDB  [SSOP16_M_thinPins]
X1  Manufacturer Part No.: 1473005-1  [T_Tyco_1473005-1]  (hidden comment: CON-Tyco-1473005-1-200-0.6mm)  (part J of 16)

### Ports
DGND, V3.3

### Nets
DGND: C114.1 C115.1 C117.1 P6.1 P7.1 U7.15(GND) ; port DGND
V3.3: C114.2 U7.16(VCC) ; port V3.3
UART1_RXD: P6.4 X1.33(PIN_33/UART_A_RXD)
UART1_TXD: P6.5 X1.35(PIN_35/UART_A_TXD)
UART4_RXD: U7.9(R2OUT) X1.36(PIN_36/UART_B_RXD)
UART4_RXD_RS232: P7.3 U7.8(R2IN)
UART4_TXD: U7.10(T2IN) X1.38(PIN_38/UART_B_TXD)
UART4_TXD_RS232: P7.2 U7.7(T2OUT)
NetC113_1: C113.1 U7.3(C1-)
NetC113_2: C113.2 U7.1(C1+)
NetC115_2: C115.2 U7.2(V+)
NetC116_1: C116.1 U7.5(C2-)
NetC116_2: C116.2 U7.4(C2+)
NetC117_2: C117.2 U7.6(V-)

Not connected (* = marked no-connect by the designer): P6 2 3 6; P7 4; U7 11(T1IN)* 12(R1OUT)* 13(R1IN)* 14(T1OUT)*; X1 19(PIN_19/UART_C_RXD) 21(PIN_21/UART_C_TXD) 23(PIN_23/UART_A_DTR) 25(PIN_25/UART_A_CTS) 27(PIN_27/UART_A_RTS) 29(PIN_29/UART_A_DSR) 31(PIN_31/UART_A_DCD) 32(PIN_32/UART_B_CTS) 34(PIN_34/UART_B_RTS) 37(PIN_37/UART_A_RI)

### Notes on the sheet
- Title:
- Description:
- Size:
- Date:
- Name:
- Number:
- Time:
- Revision:
- Sheet
- Checked:
- of
- File:
- (in symbol CON-Tyco-1473005-1-200-0.6mm, part J) Colibri - UART; 10 of 16

### Library data of the parts
C113-C117 = C: as C13 on sheet PATHOS_FPGA_Power; #Published: 2006-10-07; #ClassSub: Capacitor; Type: *; Voltage Maximum: *; Value: 100nF
P6 = Header 1x6: Header, 6-Pin; LatestRevisionDate: 17-Jul-2002; LatestRevisionNote: Re-released for DXP Platform.; Publisher: Altium Limited
P7 = Header 4: Header, 4-Pin; LatestRevisionDate: 17-Jul-2002; LatestRevisionNote: Re-released for DXP Platform.; Publisher: Altium Limited
U7 = MAX3232ECAE: ±15kV ESD-Protected, 3.0V to 5.5V, Low-Power, up to 250kbps, True RS-232 Transceiver; Published: 16-Jan-2001; LatestRevisionDate: 29-May-2009; LatestRevisionNote: IPC-7351 Footprint Added.; DatasheetVersion: Mar-1999; PackageVersion: 1996; PackageReference: SSOP16; Publisher: Altium Limited; PackageDescription: 16-Pin Small Outline Package 0.65 mm Pitch; Code_JEDEC: MO-150-AC; Code_IPC: SOP65P780-16; ComponentLink1Description: Manufacturer Link; ComponentLink1URL: http://www.maxim-ic.com/; ComponentLink2Description: Datasheet; ComponentLink2URL: http://pdfserv.maxim-ic.com/en/ds/MAX3222E-MAX3246E.pdf
X1 = CON-Tyco-1473005-1-200-0.6mm: as X1 on sheet PATHOS_SOM_Power

## Sheet PATHOS_SOM_Ethernet.SchDoc: Ethernet to SOM
size A4; Author: A. Kalberer; CompanyName: NTB; Organization: NTB Interstate University of Applied; Address1: Werdenbergstrasse 4; Address3: 9471 Buchs; Address4: Switzerland; Organization1: Sciences of Technology Buchs; Size: A4
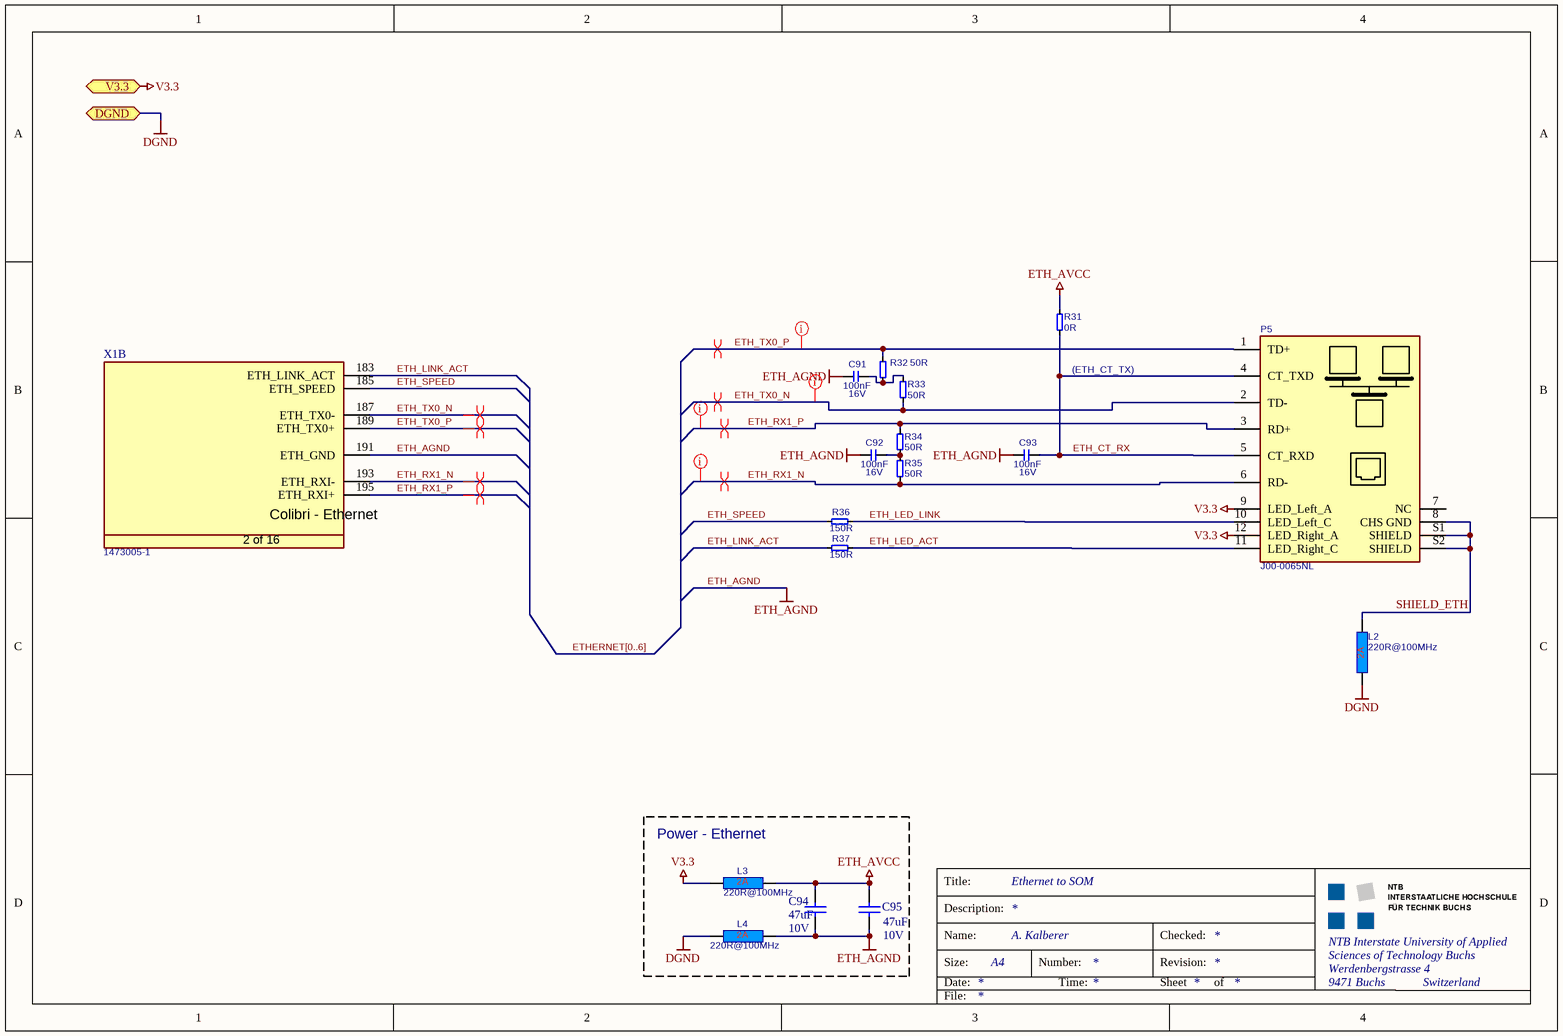
[diagram p11: PATHOS_SOM_Ethernet.SchDoc]

### Parts
C91  Rating: 16V  [0603_3D]  (hidden comment: 100nF)
C92  Rating: 16V  [0603_3D]  (hidden comment: 100nF)
C93  Rating: 16V  [0603_3D]  (hidden comment: 100nF)
C94  Voltage Maximum: 10V  [0805_3D]  (hidden comment: 47uF)
C95  Voltage Maximum: 10V  [0805_3D]  (hidden comment: 47uF)
L2  220R@100MHz  [0603_3D]
L3  220R@100MHz  [0603_3D]
L4  220R@100MHz  [0603_3D]
P5  J00-0065NL  [T_PULSE_J00-0065NL]
R31  0R  [0603_3D]
R32  50R  [0603_3D]
R33  50R  [0603_3D]
R34  50R  [0603_3D]
R35  50R  [0603_3D]
R36  150R  [0603_3D]
R37  150R  [0603_3D]
X1  Manufacturer Part No.: 1473005-1  [T_Tyco_1473005-1]  (hidden comment: CON-Tyco-1473005-1-200-0.6mm)  (part B of 16)

### Blocks framed on the sheet
Power - Ethernet: C94 C95 L3 L4

### Ports
DGND, V3.3

### Nets
DGND: L2.1 L4.1 ; port DGND
ETH_AGND: C91.1 C92.1 C93.1 C94.1 C95.1 L4.2 X1.191(ETH_GND)
ETH_AVCC: C94.2 C95.2 L3.2 R31.1
V3.3: L3.1 P5.9(LED_Left_A) P5.12(LED_Right_A) ; port V3.3
ETH_CT_RX: C93.2 P5.4(CT_TXD) P5.5(CT_RXD) R31.2
ETH_LED_ACT: P5.11(LED_Right_C) R37.2
ETH_LED_LINK: P5.10(LED_Left_C) R36.2
ETH_LINK_ACT: R37.1 X1.183(ETH_LINK_ACT)
ETH_RX1_N: P5.6(RD-) R35.1 X1.193(ETH_RXI-)
ETH_RX1_P: P5.3(RD+) R34.2 X1.195(ETH_RXI+)
ETH_SPEED: R36.1 X1.185(ETH_SPEED)
ETH_TX0_N: P5.2(TD-) R33.1 X1.187(ETH_TX0-)
ETH_TX0_P: P5.1(TD+) R32.2 X1.189(ETH_TX0+)
SHIELD_ETH: L2.2 P5.8(CHS_GND) P5.S1(SHIELD) P5.S2(SHIELD)
NetC91_2: C91.2 R32.1 R33.2
NetC92_2: C92.2 R34.1 R35.2

Not connected (* = marked no-connect by the designer): P5 7(NC)

### Buses and harness runs
bus ETHERNET[0..6]

### Layout directives
differential pair: ETH_RX1_N, ETH_RX1_P, ETH_TX0_N, ETH_TX0_P
net class ETH_TX0: ETH_TX0_N, ETH_TX0_P
net class ETH_RX1: ETH_RX1_N, ETH_RX1_P

### Notes on the sheet
- (near R31) (ETH_CT_TX)
- Title:
- Description:
- Size:
- Date:
- Name:
- Number:
- Time:
- Revision:
- Sheet
- Checked:
- of
- File:
- (in symbol CON-Tyco-1473005-1-200-0.6mm, part B) Colibri - Ethernet; 2 of 16

### Library data of the parts
C91-C93 = C-X7R-100nF-16V-10%-0603: Capacitor Ceramic X7R 100nF 16V 10% 0603; Tolerance: 10%; Type: X7R; Value: 100nF
C94 C95 = C: as C11 on sheet PATHOS_FPGA_Power; #Published: 2006-10-07; #ClassSub: Capacitor; Value: 47uF
L2-L4 = L-220R@100MHz-2A-25%-0603: as L1 on sheet PATHOS_FPGA_Power; Rating: 2A; Value: 220R@100MHz
P5 = CON-Pulse-J00-0065NL: RJ45 Connector; Manufacturer Name: Pulse; No. of ways: 12; Manufacturer Part No.: J00-0065NL
R31 = R-0R-100mW-JP-0603: Resistor 0 ohm 100mW Jumper 0603; Rating: 63mW; Tolerance: 1%; Value: 0R
R32-R35 = R-50R-63mW-1%-0603: Resistor 50 ohm 63mW 1% 0603; Rating: 63mW; Tolerance: 1%; Value: 50R
R36 R37 = R-150R-63mW-1%-0603: Resistor 150 ohm 63mW 1% 0603; Rating: 63mW; Tolerance: 1%; Value: 150R
X1 = CON-Tyco-1473005-1-200-0.6mm: as X1 on sheet PATHOS_SOM_Power